# Altium project carrier.PrjPcb (part 1 of 2)
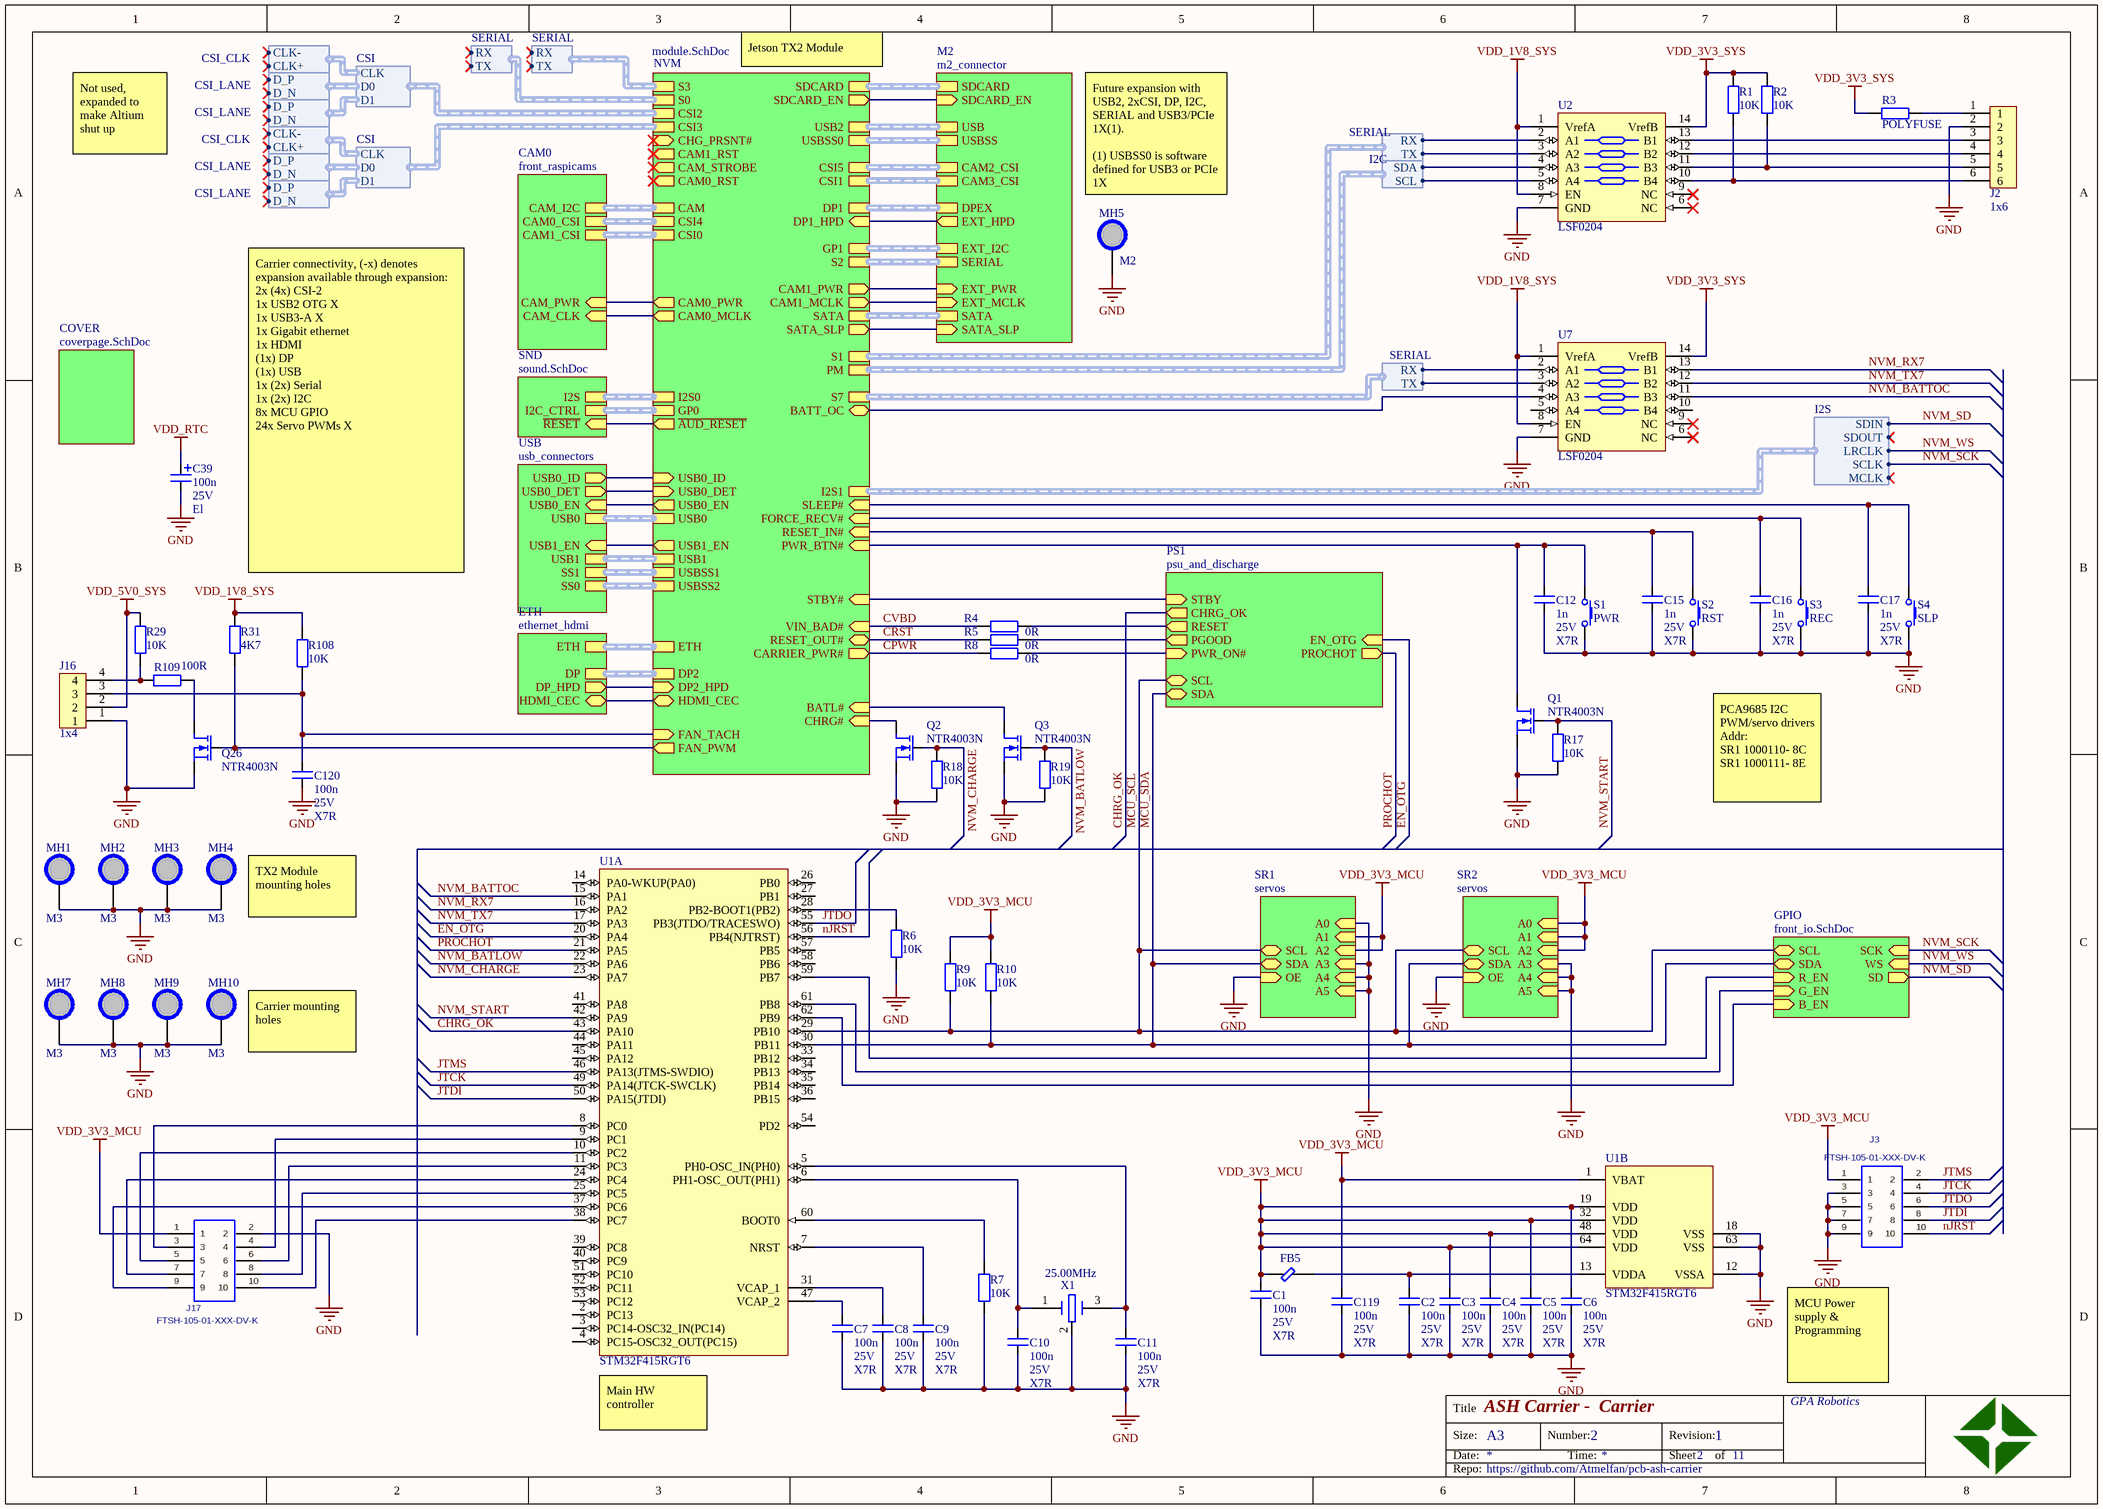
[diagram p0: carrier.SchDoc]
project_url: https://github.com/Atmelfan/pcb-ash-carrier; project_revision: 1; project_repo: https://github.com/Atmelfan/pcb-ash-carrier; project_name: ASH Carrier; project_author: Gustav Palmqvist
11 sheets, 384 parts. Net scope: hierarchical (ports join the sheet entries above them; power ports are global).
Board file: carrier.PcbDoc
Sheets:
  carrier.SchDoc
    NVM = module.SchDoc
    SR1 = servos.SchDoc
    SR2 = servos.SchDoc
    CAM0 = front_raspicams.SchDoc
    PS1 = psu_and_discharge.SchDoc
    USB = usb_connectors.SchDoc
    ETH = ethernet_hdmi.SchDoc
    M2 = m2_connector.SchDoc
    SND = sound.SchDoc
    GPIO = front_io.SchDoc
    COVER = coverpage.SchDoc

## Sheet carrier.SchDoc: Carrier
size A3; Organization: GPA Robotics; DocumentNumber: 2; Revision: REV 0; SheetNumber: 2; SheetTotal: 11

### Parts
C1  value 100n  Voltage: 25V  Type: X7R  [C1005[0402]]  (hidden comment: cap)
C2  value 100n  Voltage: 25V  Type: X7R  [C1005[0402]]  (hidden comment: cap)
C3  value 100n  Voltage: 25V  Type: X7R  [C1005[0402]]  (hidden comment: cap)
C4  value 100n  Voltage: 25V  Type: X7R  [C1005[0402]]  (hidden comment: cap)
C5  value 100n  Voltage: 25V  Type: X7R  [C1005[0402]]  (hidden comment: cap)
C6  value 100n  Voltage: 25V  Type: X7R  [C1005[0402]]  (hidden comment: cap)
C7  value 100n  Voltage: 25V  Type: X7R  [C1005[0402]]  (hidden comment: cap)
C8  value 100n  Voltage: 25V  Type: X7R  [C1005[0402]]  (hidden comment: cap)
C9  value 100n  Voltage: 25V  Type: X7R  [C1005[0402]]  (hidden comment: cap)
C10  value 100n  Voltage: 25V  Type: X7R  [C1005[0402]]  (hidden comment: cap)
C11  value 100n  Voltage: 25V  Type: X7R  [C1005[0402]]  (hidden comment: cap)
C12  value 1n  Voltage: 25V  Type: X7R  [C1005[0402]]  (hidden comment: cap)
C15  value 1n  Voltage: 25V  Type: X7R  [C1005[0402]]  (hidden comment: cap)
C16  value 1n  Voltage: 25V  Type: X7R  [C1005[0402]]  (hidden comment: cap)
C17  value 1n  Voltage: 25V  Type: X7R  [C1005[0402]]  (hidden comment: cap)
C39  value 100n  Voltage: 25V  Type: El  [SC_DSK-3R3H224U-HL]  (hidden comment: pcap)
C119  value 100n  Voltage: 25V  Type: X7R  [C1005[0402]]  (hidden comment: cap)
C120  value 100n  Voltage: 25V  Type: X7R  [C1005[0402]]  (hidden comment: cap)
FB5  2506036007Y3  [FBC1608X07N]  (value not drawn)
J2  1x6  [hdr_100mil_1x6]
J3  FTSH-105-01-XXX-DV-K  [FTSH-105-01-XXX-DV-K]
J16  1x4  [molex_picoblade_1x4]
J17  FTSH-105-01-XXX-DV-K  [FTSH-105-01-XXX-DV-K]
MH1  M3  [m3_pan_tight_round]
MH2  M3  [m3_pan_tight_round]
MH3  M3  [m3_pan_tight_round]
MH4  M3  [m3_pan_tight_round]
MH5  M2  [m2_pan_tight_round]
MH7  M3  [m3_pan_tight_round]
MH8  M3  [m3_pan_tight_round]
MH9  M3  [m3_pan_tight_round]
MH10  M3  [m3_pan_tight_round]
Q1  NTR4003N  [NCH_SOT95P237X110-3N]
Q2  NTR4003N  [NCH_SOT95P237X110-3N]
Q3  NTR4003N  [NCH_SOT95P237X110-3N]
Q26  NTR4003N  [NCH_SOT95P237X110-3N]
R1  value 10K  [R1005[0402]]  (hidden comment: res)
R2  value 10K  [R1005[0402]]  (hidden comment: res)
R3  value POLYFUSE  [R1005[0402]]  (hidden comment: res)
R4  value 0R  [R1005[0402]]  (hidden comment: res)
R5  value 0R  [R1005[0402]]  (hidden comment: res)
R6  value 10K  [R1005[0402]]  (hidden comment: res)
R7  value 10K  [R1005[0402]]  (hidden comment: res)
R8  value 0R  [R1005[0402]]  (hidden comment: res)
R9  value 10K  [R1005[0402]]  (hidden comment: res)
R10  value 10K  [R1005[0402]]  (hidden comment: res)
R17  value 10K  [R1005[0402]]  (hidden comment: res)
R18  value 10K  [R1005[0402]]  (hidden comment: res)
R19  value 10K  [R1005[0402]]  (hidden comment: res)
R29  value 10K  [R1005[0402]]  (hidden comment: res)
R31  value 4K7  [R1005[0402]]  (hidden comment: res)
R108  value 10K  [R1005[0402]]  (hidden comment: res)
R109  value 100R  [R1005[0402]]  (hidden comment: res)
S1  PWR  [SW_6MM_TACT]
S2  RST  [SW_6MM_TACT]
S3  REC  [SW_6MM_TACT]
S4  SLP  [SW_6MM_TACT]
U1  STM32F415RGT6  [STM-LQFP64_N]  (parts A,B of 2)
U2  LSF0204  [TI_TSOP65P640X120-14N]
U7  LSF0204  [TI_TSOP65P640X120-14N]
X1  value 25.00MHz  [FA-238]  (hidden comment: crystal_shielded)

### Sub-sheets
CAM0 = front_raspicams: CAM0_CSI (harness CSI), CAM_I2C (harness I2C), CAM_CLK (in), CAM_PWR (in), CAM1_CSI (harness CSI)
COVER = coverpage.SchDoc: no entries
ETH = ethernet_hdmi: ETH (harness GBE), DP (harness DP), DP_HPD (out), HDMI_CEC (bidir)
GPIO = front_io.SchDoc: SCL (bidir), SDA (bidir), WS (in), SCK (in), R_EN (in), G_EN (in), SD (out), B_EN (in)
M2 = m2_connector: SDCARD_EN (in), SDCARD (harness SDCARD), USB (harness USB2), USBSS (harness USB3), CAM2_CSI (harness CSI), CAM3_CSI (harness CSI), DPEX (harness DP), EXT_HPD (out), EXT_I2C (harness I2C), SERIAL (harness SERIAL), EXT_PWR (in), EXT_MCLK (in), SATA_SLP (in), SATA (harness SATA)
NVM = module.SchDoc: CHRG# (in), CSI5 (harness CSI), CSI0 (harness CSI), CSI4 (harness CSI), USB0 (harness USB2), CAM (harness I2C), USB0_ID (in), CSI3 (harness CSI), BATL# (in), PM (harness I2C), CSI2 (harness CSI), STBY# (in), CSI1 (harness CSI), GP1 (harness I2C), CAM_STROBE (out), SDCARD (harness SDCARD), CAM1_MCLK (out), CAM0_MCLK (out), S7 (harness SERIAL), CAM0_PWR (out), GP0 (harness I2C), SDCARD_EN (out), USB0_EN (out), PWR_BTN# (in), S3 (harness SERIAL), S2 (harness SERIAL), S1 (harness SERIAL), SLEEP# (in), CAM0_RST (out), CAM1_PWR (out), S0 (harness SERIAL), FORCE_RECV# (in), CAM1_RST (out), USB1_EN (out), USB0_DET (in), USBSS0 (harness USB3), CHG_PRSNT# (in), CARRIER_PWR# (out), RESET_IN# (in), USBSS2 (harness USB3), USBSS1 (harness USB3), VIN_BAD# (in), USB1 (harness USB2), RESET_OUT# (bidir), ETH (harness GBE), USB2 (harness USB2), DP1 (harness DP), DP1_HPD (in), DP2 (harness DP), DP2_HPD (in), I2S0 (harness I2S), BATT_OC (bidir), ~{AUD_RESET} (out), SATA (harness SATA), SATA_SLP (out), I2S1 (harness I2S), FAN_PWM (out), FAN_TACH (in), HDMI_CEC (bidir)
PS1 = psu_and_discharge: SCL (bidir), PWR_ON# (in), PGOOD (out), SDA (bidir), RESET (out), EN_OTG (in), PROCHOT (out), CHRG_OK (out), STBY (in)
SND = sound.SchDoc: ~{RESET} (in), I2S (harness I2S), I2C_CTRL (harness I2C)
SR1 = servos: SDA (bidir), SCL (bidir), OE (in), A1 (in), A2 (in), A3 (in), A0 (in), A4 (in), A5 (in)
SR2 = servos: SDA (bidir), SCL (bidir), OE (in), A1 (in), A2 (in), A3 (in), A0 (in), A4 (in), A5 (in)
USB = usb_connectors: USB0 (harness USB2), USB1 (harness USB2), SS1 (harness USB3), USB0_DET (out), USB0_EN (in), USB0_ID (out), USB1_EN (in), SS0 (harness USB3)

### Harnesses
SERIAL: RX, TX
I2C: SDA, SCL
I2S: SDIN, SDOUT, LRCLK, SCLK, MCLK
CSI: CLK, D0, D1
CSI_CLK: CLK-, CLK+
CSI_LANE: D_P, D_N

### Nets
GND: C1.2 C2.2 C3.2 C4.2 C5.2 C6.2 C7.2 C8.2 C9.2 C10.2 C11.2 C12.1 C15.1 C16.1 C17.1 C39.2 C119.2 C120.1 J2.2 J3.3 J3.5 J3.7 J3.9 J16.1 J17.2 MH1.1 MH2.1 MH3.1 MH4.1 MH5.1 MH7.1 MH8.1 MH9.1 MH10.1 Q1.S Q2.S Q3.S Q26.S R6.1 R7.1 R17.1 R18.1 R19.1 S1.2 S2.2 S3.2 S4.2 U1.12(VSSA) U1.18(VSS) U1.63(VSS) U2.7(GND) U7.7(GND) X1.2 ; sheet SR1/OE, sheet SR1/A3, sheet SR1/A0, sheet SR1/A4, sheet SR1/A5, sheet SR2/OE, sheet SR2/A3, sheet SR2/A4, sheet SR2/A5
VDD_1V8_SYS: R31.2 R108.2 U2.1(VrefA) U2.8(EN) U7.1(VrefA) U7.8(EN)
VDD_3V3_MCU: C1.1 C3.1 C4.1 C5.1 C6.1 C119.1 FB5.1 J3.1 J17.1 R9.2 R10.2 U1.1(VBAT) U1.19(VDD) U1.32(VDD) U1.48(VDD) U1.64(VDD) ; sheet SR1/A1, sheet SR1/A2, sheet SR2/A1, sheet SR2/A2, sheet SR2/A0
VDD_3V3_SYS: R1.2 R2.2 R3.2 U2.14(VrefB) U7.14(VrefB)
VDD_5V0_SYS: J16.2 R29.1
VDD_RTC: C39.1
CHRG_OK: U1.43(PA10) ; sheet PS1/CHRG_OK
CPWR: R8.1 ; sheet NVM/CARRIER_PWR#
CRST: R5.1 ; sheet NVM/RESET_OUT#
CVBD: R4.1 ; sheet NVM/VIN_BAD#
EN_OTG: U1.20(PA4) ; sheet PS1/EN_OTG
JTCK: J3.4 U1.49(PA14(JTCK-SWCLK))
JTDI: J3.8 U1.50(PA15(JTDI))
JTDO: J3.6 U1.55(PB3(JTDO/TRACESWO))
JTMS: J3.2 U1.46(PA13(JTMS-SWDIO))
MCU_SCL: R9.1 U1.29(PB10) ; sheet SR1/SCL, sheet SR2/SCL, sheet PS1/SCL, sheet GPIO/SCL
MCU_SDA: R10.1 U1.30(PB11) ; sheet SR1/SDA, sheet SR2/SDA, sheet PS1/SDA, sheet GPIO/SDA
nJRST: J3.10 U1.56(PB4(NJTRST))
NVM_BATLOW: Q3.G R19.2 U1.22(PA6)
NVM_BATTOC: U1.15(PA1) U7.11(B3)
NVM_CHARGE: Q2.G R18.2 U1.23(PA7)
NVM_RX7: U1.16(PA2) U7.13(B1)
NVM_SCK: sheet GPIO/SCK, sheet NVM/I2S1.SCLK
NVM_SD: sheet GPIO/SD, sheet NVM/I2S1.SDIN
NVM_START: Q1.G R17.2 U1.42(PA9)
NVM_TX7: U1.17(PA3) U7.12(B2)
NVM_WS: sheet GPIO/WS, sheet NVM/I2S1.LRCLK
PROCHOT: U1.21(PA5) ; sheet PS1/PROCHOT
NetC2_1: C2.1 FB5.2 U1.13(VDDA)
NetC7_1: C7.1 U1.47(VCAP_2)
NetC8_1: C8.1 U1.31(VCAP_1)
NetC9_1: C9.1 U1.7(NRST)
NetC10_1: C10.1 U1.6(PH1-OSC_OUT(PH1)) X1.1
NetC11_1: C11.1 U1.5(PH0-OSC_IN(PH0)) X1.3
NetC12_2: C12.2 Q1.D S1.1 ; sheet NVM/PWR_BTN#
NetC15_2: C15.2 S2.1 ; sheet NVM/RESET_IN#
NetC16_2: C16.2 S3.1 ; sheet NVM/FORCE_RECV#
NetC17_2: C17.2 S4.1 ; sheet NVM/SLEEP#
NetC94_2: sheet NVM/USB0_DET, sheet USB/USB0_DET
NetC120_2: C120.2 J16.3 R108.1 ; sheet NVM/FAN_TACH
NetD13_5: sheet NVM/USB0_ID, sheet USB/USB0_ID
NetJ1_A6: U2.5(A4) ; sheet NVM/PM.SCL
NetJ1_A7: Q2.D ; sheet NVM/CHRG#
NetJ1_A17: sheet NVM/USB0_EN, sheet USB/USB0_EN
NetJ1_A18: sheet NVM/USB1_EN, sheet USB/USB1_EN
NetJ1_A33: sheet NVM/DP1_HPD, sheet M2/EXT_HPD
NetJ1_B6: U2.4(A3) ; sheet NVM/PM.SDA
NetJ1_B7: sheet NVM/STBY#, sheet PS1/STBY
NetJ1_B33: sheet NVM/HDMI_CEC, sheet ETH/HDMI_CEC
NetJ1_B36: sheet NVM/DP2_HPD, sheet ETH/DP_HPD
NetJ1_C7: Q3.D ; sheet NVM/BATL#
NetJ1_C8: U7.4(A3) ; sheet NVM/BATT_OC
NetJ1_C16: Q26.G R31.1 ; sheet NVM/FAN_PWM
NetJ1_D5: U7.2(A1) ; sheet NVM/S7.RX
NetJ1_D8: U7.3(A2) ; sheet NVM/S7.TX
NetJ1_D9: U2.3(A2) ; sheet NVM/S1.TX
NetJ1_D10: U2.2(A1) ; sheet NVM/S1.RX
NetJ1_D47: sheet NVM/SATA_SLP, sheet M2/SATA_SLP
NetJ1_F2: sheet NVM/~{AUD_RESET}, sheet SND/~{RESET}
NetJ1_F7: sheet NVM/CAM1_PWR, sheet M2/EXT_PWR
NetJ1_F8: sheet NVM/CAM1_MCLK, sheet M2/EXT_MCLK
NetJ1_F9: sheet NVM/CAM0_MCLK, sheet CAM0/CAM_CLK
NetJ1_G8: sheet NVM/CAM0_PWR, sheet CAM0/CAM_PWR
NetJ1_H16: sheet NVM/SDCARD_EN, sheet M2/SDCARD_EN
NetJ2_1: J2.1 R3.1
NetJ2_3: J2.3 U2.13(B1)
NetJ2_4: J2.4 U2.12(B2)
NetJ2_5: J2.5 R2.1 U2.11(B3)
NetJ2_6: J2.6 R1.1 U2.10(B4)
NetJ16_4: J16.4 R29.2 R109.1
NetJ17_3: J17.3 U1.8(PC0)
NetJ17_4: J17.4 U1.9(PC1)
NetJ17_5: J17.5 U1.10(PC2)
NetJ17_6: J17.6 U1.11(PC3)
NetJ17_7: J17.7 U1.24(PC4)
NetJ17_8: J17.8 U1.25(PC5)
NetJ17_9: J17.9 U1.37(PC6)
NetJ17_10: J17.10 U1.38(PC7)
NetQ9_G: R4.2 ; sheet PS1/RESET
NetQ10_D: R5.2 ; sheet PS1/PGOOD
NetQ13_G: R8.2 ; sheet PS1/PWR_ON#
NetQ26_D: Q26.D R109.2
NetR6_2: R6.2 U1.28(PB2-BOOT1(PB2))
NetR7_2: R7.2 U1.60(BOOT0)
NetU1_59: U1.59(PB7) ; sheet GPIO/R_EN
NetU1_61: U1.61(PB8) ; sheet GPIO/G_EN
NetU1_62: U1.62(PB9) ; sheet GPIO/B_EN

Not connected (* = marked no-connect by the designer): U1 2(PC13) 3(PC14-OSC32_IN(PC14)) 4(PC15-OSC32_OUT(PC15)) 14(PA0-WKUP(PA0)) 26(PB0) 27(PB1) 33(PB12) 34(PB13) 35(PB14) 36(PB15) 39(PC8) 40(PC9) 41(PA8) 44(PA11) 45(PA12) 51(PC10) 52(PC11) 53(PC12) 54(PD2) 57(PB5) 58(PB6); U2 6(NC)* 9(NC)*; U7 5(A4) 6(NC)* 9(NC)* 10(B4)

### Buses and harness runs
harness sheet CAM0/CAM0_CSI = sheet NVM/CSI4
harness sheet CAM0/CAM1_CSI = sheet NVM/CSI0
harness sheet CAM0/CAM_I2C = sheet NVM/CAM
harness sheet ETH/DP = sheet NVM/DP2
harness sheet ETH/ETH = sheet NVM/ETH
harness sheet M2/CAM2_CSI = sheet NVM/CSI5
harness sheet M2/CAM3_CSI = sheet NVM/CSI1
harness sheet M2/DPEX = sheet NVM/DP1
harness sheet M2/EXT_I2C = sheet NVM/GP1
harness sheet M2/SATA = sheet NVM/SATA
harness sheet M2/SDCARD = sheet NVM/SDCARD
harness sheet M2/SERIAL = sheet NVM/S2
harness sheet M2/USB = sheet NVM/USB2
harness sheet M2/USBSS = sheet NVM/USBSS0
harness sheet NVM/GP0 = sheet SND/I2C_CTRL
harness sheet NVM/I2S0 = sheet SND/I2S
harness sheet NVM/USB0 = sheet USB/USB0
harness sheet NVM/USB1 = sheet USB/USB1
harness sheet NVM/USBSS1 = sheet USB/SS1
harness sheet NVM/USBSS2 = sheet USB/SS0

### Notes on the sheet
- Jetson TX2 Module
- Not used, expanded to make Altium shut up
- Future expansion with USB2, 2xCSI, DP, I2C, SERIAL and USB3/PCIe 1X(1).
  (1) USBSS0 is software defined for USB3 or PCIe 1X
- Carrier connectivity, (-x) denotes expansion available through expansion:
  2x (4x) CSI-2
  1x USB2 OTG X
  1x USB3-A X
  1x Gigabit ethernet
  1x HDMI
  (1x) DP
  (1x) USB
  1x (2x) Serial
  1x (2x) I2C
  8x MCU GPIO
  24x Servo PWMs X
- PCA9685 I2C PWM/servo drivers
  Addr:
  SR1 1000110- 8C
  SR1 1000111- 8E
- (near MH4) TX2 Module mounting holes
- (near MH10) Carrier mounting holes
- MCU Power supply & Programming
- (near U1) Main HW controller
- Title
- Size:
- Date:
- A3
- Number:
- Time:
- Revision:
- Sheet
- of
- Repo:

### Library data of the parts
C1-C12 C15-C17 C119 C120 = cap: Capacitor; Manufacturer: *; Series: *
C39 = pcap: Polarized capacitor; Manufacturer: *; Series: *
FB5 = ferrite_bead: Ferrite bead
J2 = header_1x6
J3 J17 = FTSH-105-01-XXX-DV-K: TERMINAL STRIP, .050"(1.27mm) PITCH, 10 PINS, KEYED; MANUFACTURER: SAMTEC; CREATED: November 30, 2016 - Wendy Xin; PCB DECAL: FTSH-105-01-XXX-DV-K
J16 = header_1x4
MH1-MH5 MH7-MH10 = mounting_hole
Q1-Q3 Q26 = nch_mosfet
R1-R10 R17-R19 = res: Resistor
R29 R31 R108 R109 = res: Resistor; Tolerance: 5%
S1-S4 = btn
  S1: Text: PWR
  S2: Text: RST
  S3: Text: REC
  S4: Text: SLP
U1 = STM32F415RGT6: ARM Cortex-M4 32-bit MCU+FPU, 210 DMIPS, 1024 kB Flash, 192 kB Internal RAM, 51 I/Os, 64-pin LQFP, -40 to 85 degC, Tray; Manufacturer: STMicroelectronics; D/A Converter: 2x12-bit; FLASH Size (Prog) (kB): 1024; I/Os (High Current): 51; Internal RAM Size (kB): 192; Operating Frequency(F) (Processor speed) (MHz): 168; Supply Voltage(Vcc) max (V): 3.6; Supply Voltage(Vcc) min (V): 1.8; DatasheetVersion: Rev. 4; PackageVersion: Rev. 4, 06/2013; PackageReference: LQFP64; PackageDescription: 64-Pin Low Profile Quad Flat Package, 10 x 10 mm Body, 0.5 mm Pitch; Supplier 1: Digi-Key; Supplier Part Number 1: 497-11907-ND; Supplier 2: Farnell; Supplier Part Number 2: 2064370; Supplier 3: Newark; Supplier Part Number 3: 73T2335; Supplier 4: Mouser; Supplier Part Number 4: 511-STM32F415RGT6; Core: ARM Cortex-M4; Packing: Tray; Mounting Technology: Surface Mount; PartNumber: STM32F415RGT6; ComponentLink1Description: Manufacturer URL; ComponentLink1URL: http://www.st.com/web/en/home.html; ComponentLink2Description: Datasheet; ComponentLink2URL: http://www.st.com/st-web-ui/static/active/en/resource/technical/document/datasheet/DM00035129.pdf; ComponentLink3Description: Package Specification; ComponentLink3URL: http://www.st.com/st-web-ui/static/active/en/resource/technical/document/datasheet/DM00037051.pdf
X1 = crystal_shielded: Crystal with shield

## Sheet module.SchDoc: NVM connections
size A3; Organization: GPA Robotics; DocumentNumber: 3; Revision: REV 0; SheetNumber: 3; SheetTotal: 11
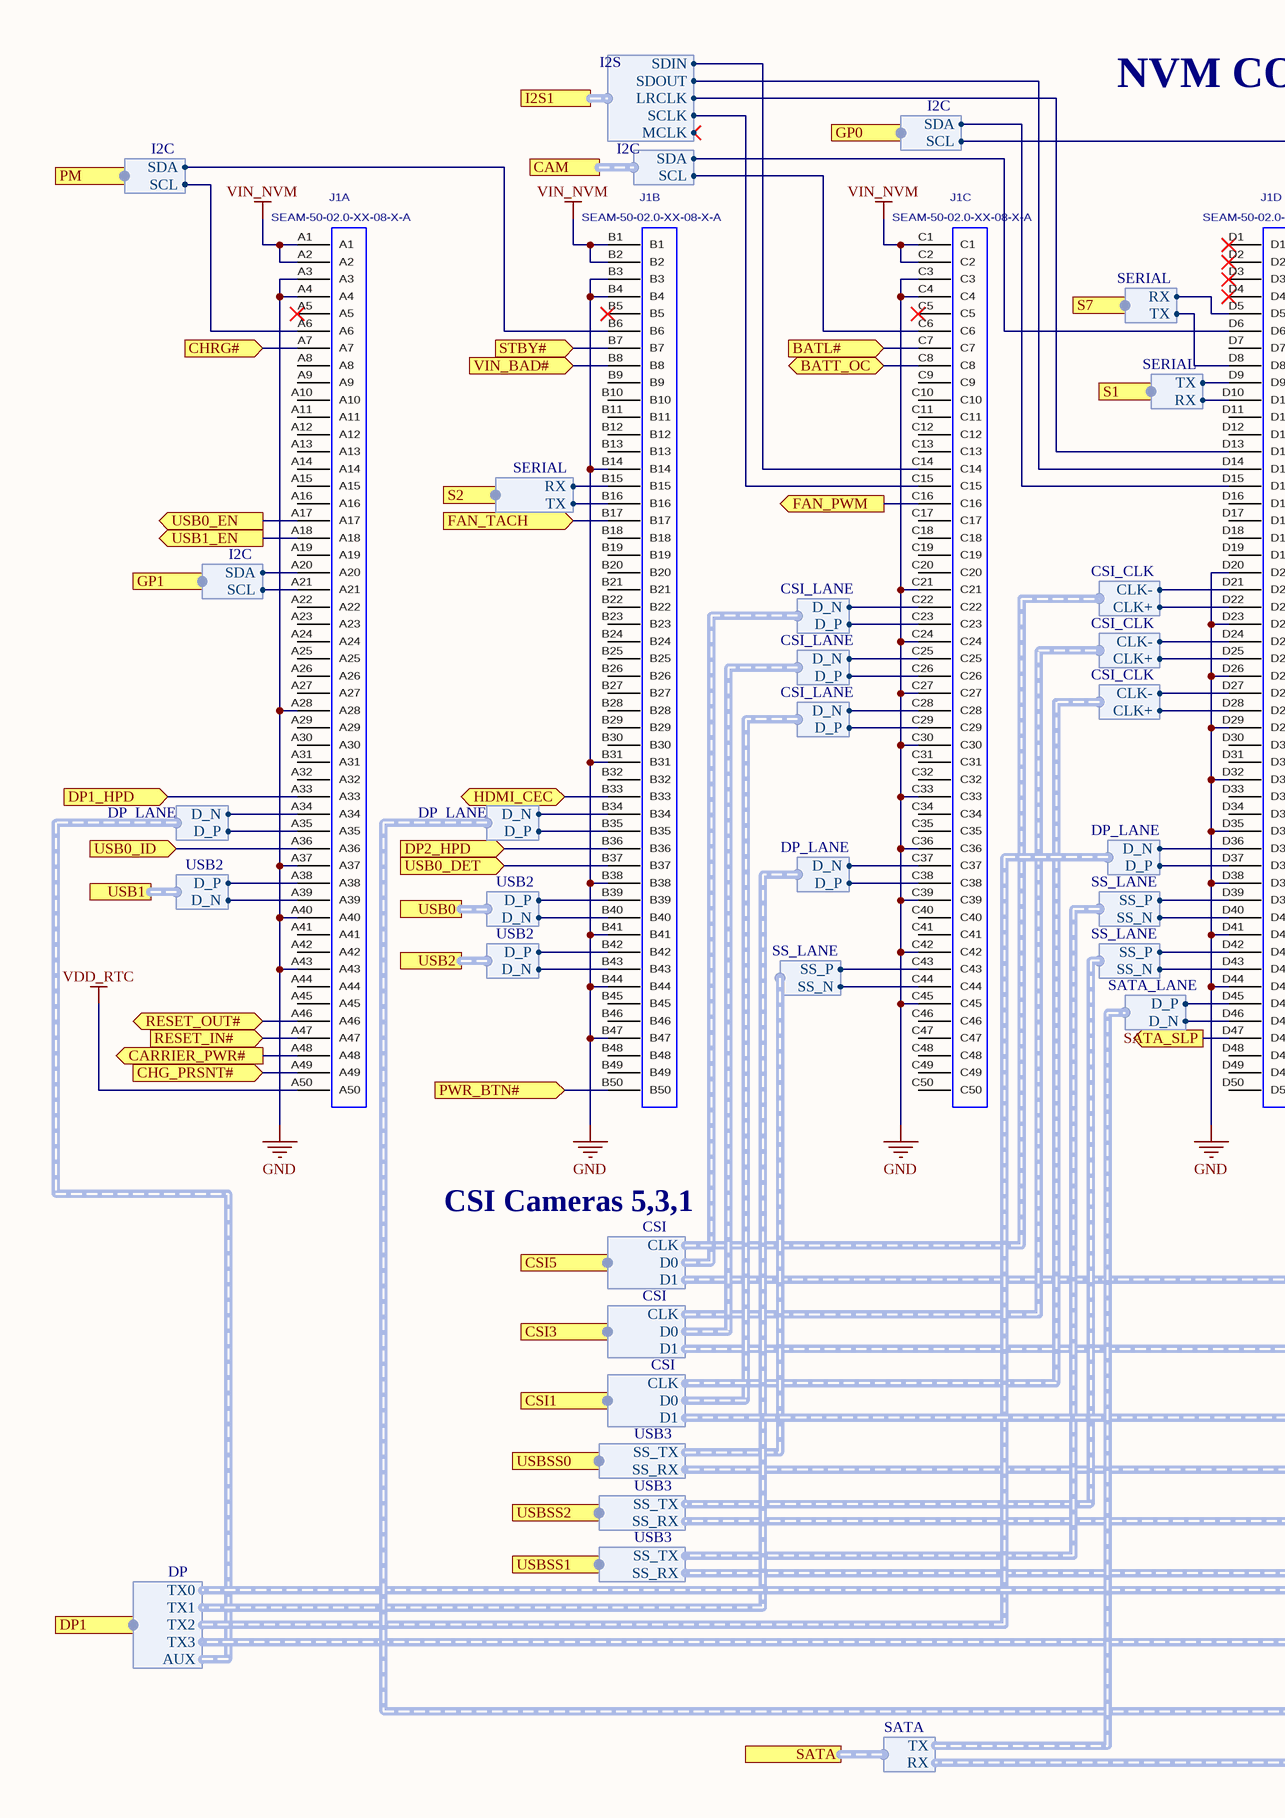
[diagram p1: module.SchDoc, left]
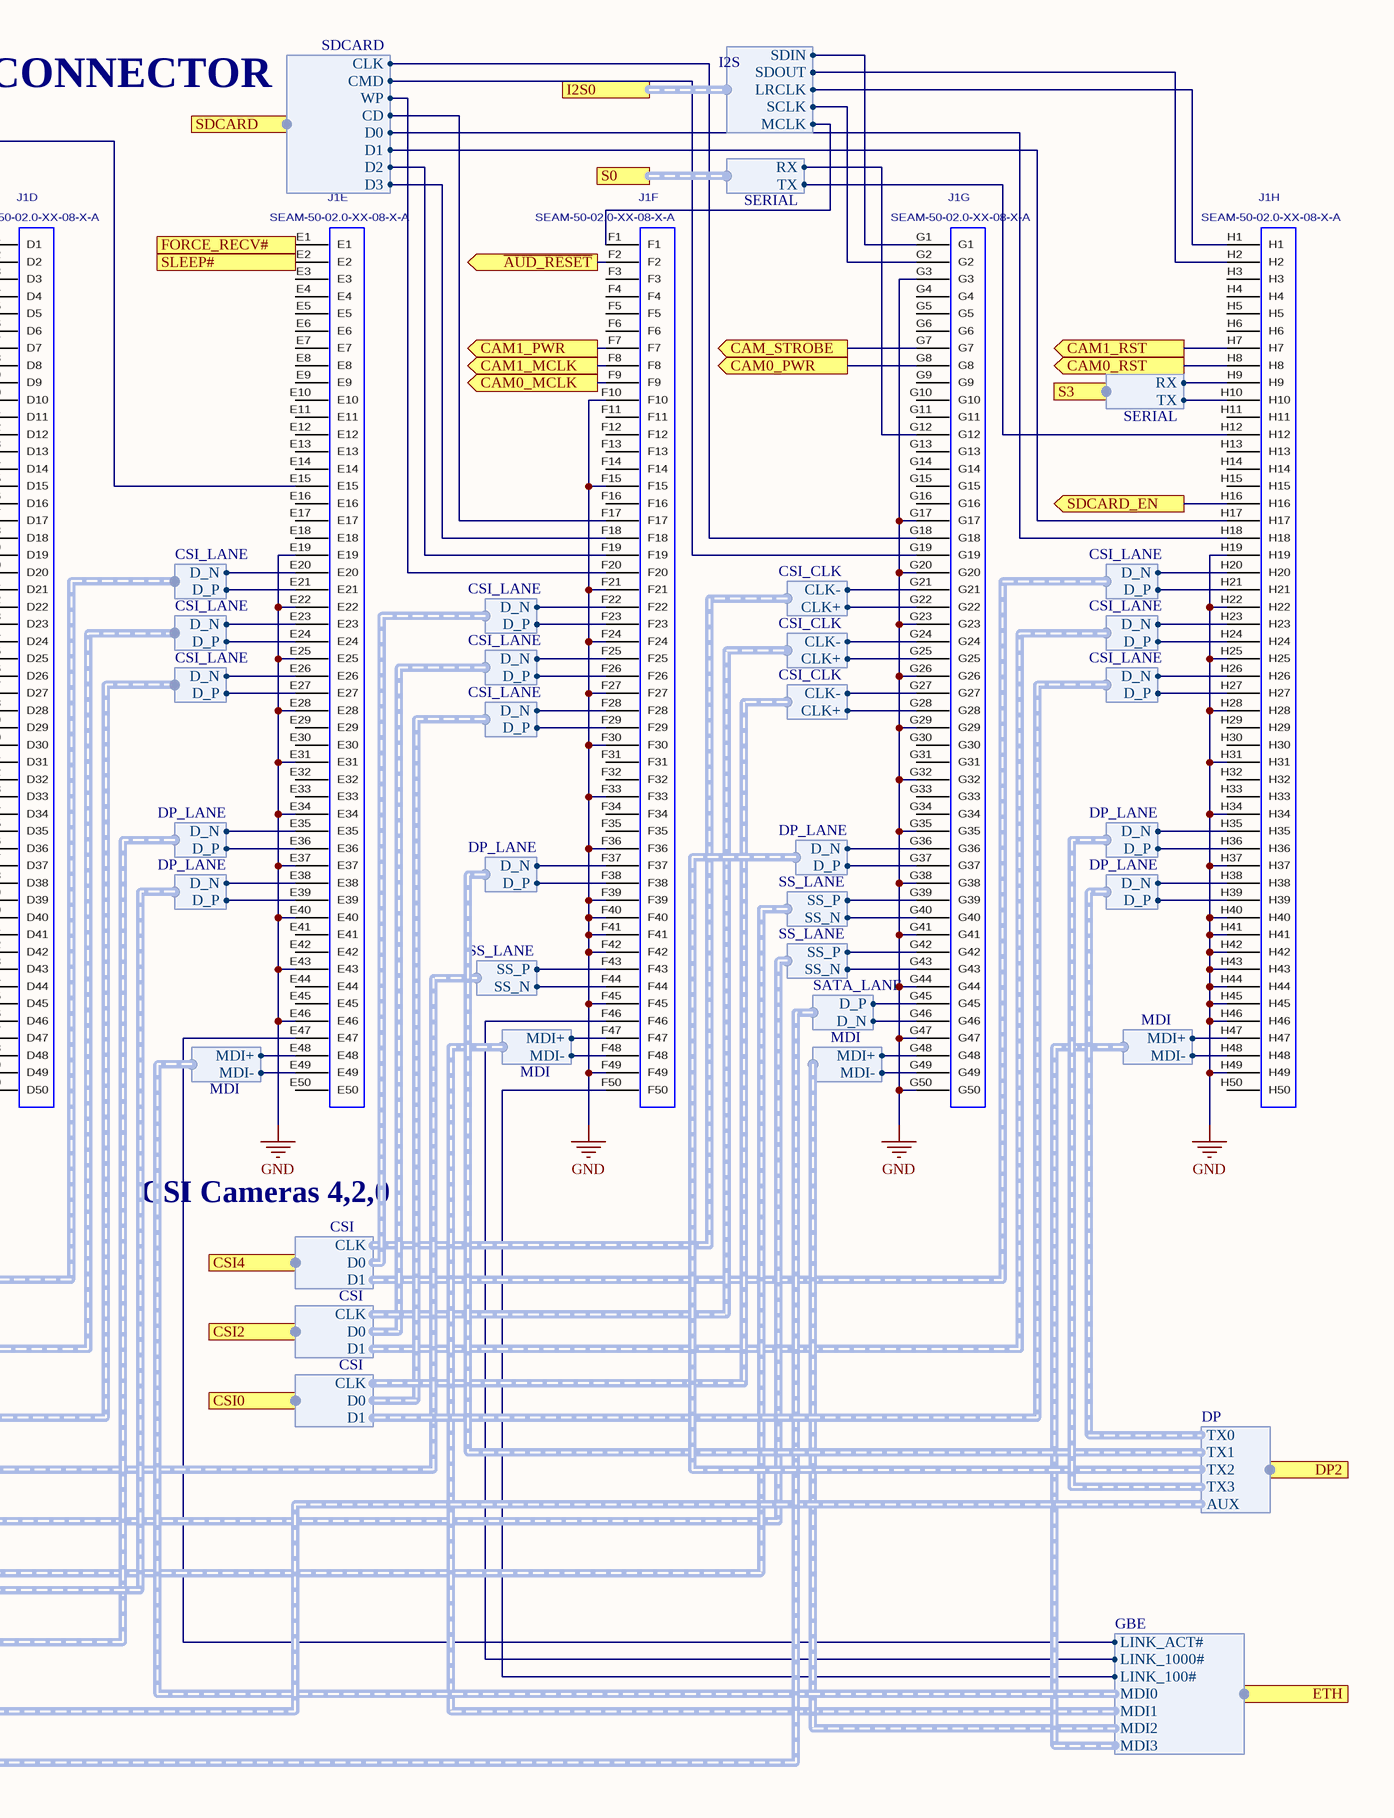
[diagram p2: module.SchDoc, right]

### Parts
J1  SEAM-50-02.0-XX-08-X-A  [SEAM-50-02.0-XX-08-X-A]  (parts A,B,C,D,E,F,G,H of 8)

### Ports
BATL# (in), BATT_OC (bidir), CAM0_MCLK (out), CAM0_PWR (out), CAM0_RST (out), CAM1_MCLK (out), CAM1_PWR (out), CAM1_RST (out), CAM (harness I2C), CAM_STROBE (out), CARRIER_PWR# (out), CHG_PRSNT# (in), CHRG# (in), CSI0 (harness CSI), CSI1 (harness CSI), CSI2 (harness CSI), CSI3 (harness CSI), CSI4 (harness CSI), CSI5 (harness CSI), DP1 (harness DP), DP1_HPD (in), DP2 (harness DP), DP2_HPD (in), ETH (harness GBE), FAN_PWM (out), FAN_TACH (in), FORCE_RECV# (in), GP0 (harness I2C), GP1 (harness I2C), HDMI_CEC (bidir), I2S0 (harness I2S), I2S1 (harness I2S), PM (harness I2C), PWR_BTN# (in), RESET_IN# (in), RESET_OUT# (bidir), S0 (harness SERIAL), S1 (harness SERIAL), S2 (harness SERIAL), S3 (harness SERIAL), S7 (harness SERIAL), SATA (harness SATA), SATA_SLP (out), SDCARD (harness SDCARD), SDCARD_EN (out), SLEEP# (in), STBY# (in), USB0 (harness USB2), USB0_DET (in), USB0_EN (out), USB0_ID (in), USB1 (harness USB2), USB1_EN (out), USB2 (harness USB2), USBSS0 (harness USB3), USBSS1 (harness USB3), USBSS2 (harness USB3), VIN_BAD# (in), ~{AUD_RESET} (out)

### Harnesses
CSI_CLK: CLK+, CLK-
CSI_LANE: D_P, D_N
CSI: D0, CLK, D1
USB3: SS_RX, SS_TX
USB2: D_P, D_N
I2C: SDA, SCL
SS_LANE: SS_P, SS_N
GBE: LINK_ACT#, LINK_1000#, LINK_100#, MDI0, MDI1, MDI2, MDI3
MDI: MDI+, MDI-
SDCARD: CLK, CMD, WP, CD, D0, D1, D2, D3
SERIAL: RX, TX
DP: TX1, TX0, TX2, TX3, AUX
DP_LANE: D_P, D_N
SATA: TX, RX
SATA_LANE: D_P, D_N
I2S: SDIN, SDOUT, LRCLK, SCLK, MCLK

### Nets
GND: J1.A3 J1.A4 J1.A28 J1.A37 J1.A40 J1.A43 J1.B3 J1.B4 J1.B14 J1.B31 J1.B38 J1.B41 J1.B44 J1.B47 J1.C3 J1.C4 J1.C21 J1.C24 J1.C27 J1.C30 J1.C33 J1.C36 J1.C39 J1.C42 J1.C45 J1.D20 J1.D23 J1.D26 J1.D29 J1.D32 J1.D35 J1.D38 J1.D41 J1.D44 J1.E19 J1.E22 J1.E25 J1.E28 J1.E31 J1.E34 J1.E37 J1.E40 J1.E43 J1.E46 J1.F10 J1.F15 J1.F21 J1.F24 J1.F27 J1.F30 J1.F33 J1.F36 J1.F39 J1.F40 J1.F41 J1.F42 J1.F45 J1.F49 J1.G3 J1.G17 J1.G20 J1.G23 J1.G26 J1.G29 J1.G32 J1.G35 J1.G38 J1.G41 J1.G44 J1.G47 J1.G50 J1.H19 J1.H22 J1.H25 J1.H28 J1.H31 J1.H34 J1.H37 J1.H40 J1.H41 J1.H42 J1.H43 J1.H44 J1.H45 J1.H46 J1.H49
VDD_RTC: J1.A50
VIN_NVM: J1.A1 J1.A2 J1.B1 J1.B2 J1.C1 J1.C2
CPWR: J1.A48 ; port CARRIER_PWR#
CRST: J1.A46 ; port RESET_OUT#
CSI0_CLK_N: J1.G21 ; harness CSI_CLK.CLK-
CSI0_CLK_P: J1.G22 ; harness CSI_CLK.CLK+
CSI0_D0_N: J1.F22 ; harness CSI_LANE.D_N
CSI0_D0_P: J1.F23 ; harness CSI_LANE.D_P
CSI0_D1_N: J1.H20 ; harness CSI_LANE.D_N
CSI0_D1_P: J1.H21 ; harness CSI_LANE.D_P
CSI1_CLK_N: J1.G27 ; harness CSI_CLK.CLK-
CSI1_CLK_P: J1.G28 ; harness CSI_CLK.CLK+
CSI1_D0_N: J1.F28 ; harness CSI_LANE.D_N
CSI1_D0_P: J1.F29 ; harness CSI_LANE.D_P
CSI1_D1_N: J1.H26 ; harness CSI_LANE.D_N
CSI1_D1_P: J1.H27 ; harness CSI_LANE.D_P
CSI2_CLK_N: J1.D21 ; harness CSI_CLK.CLK-
CSI2_CLK_P: J1.D22 ; harness CSI_CLK.CLK+
CSI2_D0_N: J1.C22 ; harness CSI_LANE.D_N
CSI2_D0_P: J1.C23 ; harness CSI_LANE.D_P
CSI2_D1_N: J1.E20 ; harness CSI_LANE.D_N
CSI2_D1_P: J1.E21 ; harness CSI_LANE.D_P
CSI3_CLK_N: J1.D27 ; harness CSI_CLK.CLK-
CSI3_CLK_P: J1.D28 ; harness CSI_CLK.CLK+
CSI3_D0_N: J1.C28 ; harness CSI_LANE.D_N
CSI3_D0_P: J1.C29 ; harness CSI_LANE.D_P
CSI3_D1_N: J1.E26 ; harness CSI_LANE.D_N
CSI3_D1_P: J1.E27 ; harness CSI_LANE.D_P
CVBD: J1.B8 ; port VIN_BAD#
DP0_D0_N: J1.H38 ; harness DP_LANE.D_N
DP0_D0_P: J1.H39 ; harness DP_LANE.D_P
DP0_D1_N: J1.F37 ; harness DP_LANE.D_N
DP0_D1_P: J1.F38 ; harness DP_LANE.D_P
DP0_D2_N: J1.G36 ; harness DP_LANE.D_N
DP0_D2_P: J1.G37 ; harness DP_LANE.D_P
DP0_D3_N: J1.H35 ; harness DP_LANE.D_N
DP0_D3_P: J1.H36 ; harness DP_LANE.D_P
DPM2_AUX_N: J1.A34 ; harness DP_LANE.D_N
DPM2_AUX_P: J1.A35 ; harness DP_LANE.D_P
DPM2_D0_N: J1.E35 ; harness DP_LANE.D_N
DPM2_D0_P: J1.E36 ; harness DP_LANE.D_P
DPM2_D1_N: J1.D36 ; harness DP_LANE.D_N
DPM2_D1_P: J1.D37 ; harness DP_LANE.D_P
DPM2_D2_N: J1.C37 ; harness DP_LANE.D_N
DPM2_D2_P: J1.C38 ; harness DP_LANE.D_P
DPM2_D3_N: J1.E38 ; harness DP_LANE.D_N
DPM2_D3_P: J1.E39 ; harness DP_LANE.D_P
MDI0_N: J1.E49 ; harness MDI.MDI-
MDI0_P: J1.E48 ; harness MDI.MDI+
MDI1_N: J1.F48 ; harness MDI.MDI-
MDI1_P: J1.F47 ; harness MDI.MDI+
MDI2_N: J1.G49 ; harness MDI.MDI-
MDI2_P: J1.G48 ; harness MDI.MDI+
MDI3_N: J1.H48 ; harness MDI.MDI-
MDI3_P: J1.H47 ; harness MDI.MDI+
NVM_SCK: J1.C15 ; port I2S1.SCLK
NVM_SD: J1.C14 ; port I2S1.SDIN
NVM_WS: J1.D13 ; port I2S1.LRCLK
SATA_RX_N: J1.G45 ; harness SATA_LANE.D_P
SATA_RX_P: J1.G46 ; harness SATA_LANE.D_N
SATA_TX_N: J1.D45 ; harness SATA_LANE.D_P
SATA_TX_P: J1.D46 ; harness SATA_LANE.D_N
SDC_CLK: J1.G18 ; port SDCARD.CLK
SDC_CMD: J1.G19 ; port SDCARD.CMD
SDC_D0: J1.H18 ; port SDCARD.D0
SDC_D1: J1.H17 ; port SDCARD.D1
SDC_D2: J1.F19 ; port SDCARD.D2
SDC_D3: J1.F18 ; port SDCARD.D3
USB0_D_N: J1.B40 ; port USB0.D_N
USB0_D_P: J1.B39 ; port USB0.D_P
USB0_RX_N: J1.G40 ; harness SS_LANE.SS_N
USB0_RX_P: J1.G39 ; harness SS_LANE.SS_P
USB0_TX_N: J1.D40 ; harness SS_LANE.SS_N
USB0_TX_P: J1.D39 ; harness SS_LANE.SS_P
USB1_D_N: J1.A39 ; port USB1.D_N
USB1_D_P: J1.A38 ; port USB1.D_P
USB1_RX_N: J1.G43 ; harness SS_LANE.SS_N
USB1_RX_P: J1.G42 ; harness SS_LANE.SS_P
USB1_TX_N: J1.D43 ; harness SS_LANE.SS_N
USB1_TX_P: J1.D42 ; harness SS_LANE.SS_P
USBM2_D_N: J1.B43 ; port USB2.D_N
USBM2_D_P: J1.B42 ; port USB2.D_P
USBM2_RX_N: J1.F44 ; harness SS_LANE.SS_N
USBM2_RX_P: J1.F43 ; harness SS_LANE.SS_P
USBM2_TX_N: J1.C44 ; harness SS_LANE.SS_N
USBM2_TX_P: J1.C43 ; harness SS_LANE.SS_P
NetC12_2: J1.B50 ; port PWR_BTN#
NetC15_2: J1.A47 ; port RESET_IN#
NetC16_2: J1.E1 ; port FORCE_RECV#
NetC17_2: J1.E2 ; port SLEEP#
NetC94_2: J1.B37 ; port USB0_DET
NetC120_2: J1.B17 ; port FAN_TACH
NetD13_5: J1.A36 ; port USB0_ID
NetD14_4: J1.F17 ; port SDCARD.CD
NetJ1_A6: J1.A6 ; port PM.SCL
NetJ1_A7: J1.A7 ; port CHRG#
NetJ1_A17: J1.A17 ; port USB0_EN
NetJ1_A18: J1.A18 ; port USB1_EN
NetJ1_A20: J1.A20 ; port GP1.SDA
NetJ1_A21: J1.A21 ; port GP1.SCL
NetJ1_A33: J1.A33 ; port DP1_HPD
NetJ1_A49: J1.A49 ; port CHG_PRSNT#
NetJ1_B6: J1.B6 ; port PM.SDA
NetJ1_B7: J1.B7 ; port STBY#
NetJ1_B15: J1.B15 ; port S2.RX
NetJ1_B16: J1.B16 ; port S2.TX
NetJ1_B33: J1.B33 ; port HDMI_CEC
NetJ1_B34: J1.B34 ; harness DP_LANE.D_N
NetJ1_B35: J1.B35 ; harness DP_LANE.D_P
NetJ1_B36: J1.B36 ; port DP2_HPD
NetJ1_C6: J1.C6 ; port CAM.SCL
NetJ1_C7: J1.C7 ; port BATL#
NetJ1_C8: J1.C8 ; port BATT_OC
NetJ1_C16: J1.C16 ; port FAN_PWM
NetJ1_C25: J1.C25 ; harness CSI_LANE.D_N
NetJ1_C26: J1.C26 ; harness CSI_LANE.D_P
NetJ1_D5: J1.D5 ; port S7.RX
NetJ1_D6: J1.D6 ; port CAM.SDA
NetJ1_D8: J1.D8 ; port S7.TX
NetJ1_D9: J1.D9 ; port S1.TX
NetJ1_D10: J1.D10 ; port S1.RX
NetJ1_D14: J1.D14 ; port I2S1.SDOUT
NetJ1_D15: J1.D15 ; port GP0.SDA
NetJ1_D24: J1.D24 ; harness CSI_CLK.CLK-
NetJ1_D25: J1.D25 ; harness CSI_CLK.CLK+
NetJ1_D47: J1.D47 ; port SATA_SLP
NetJ1_E15: J1.E15 ; port GP0.SCL
NetJ1_E23: J1.E23 ; harness CSI_LANE.D_N
NetJ1_E24: J1.E24 ; harness CSI_LANE.D_P
NetJ1_E47: J1.E47 ; port ETH.LINK_ACT#
NetJ1_F1: J1.F1 ; port I2S0.MCLK
NetJ1_F2: J1.F2 ; port ~{AUD_RESET}
NetJ1_F7: J1.F7 ; port CAM1_PWR
NetJ1_F8: J1.F8 ; port CAM1_MCLK
NetJ1_F9: J1.F9 ; port CAM0_MCLK
NetJ1_F20: J1.F20 ; port SDCARD.WP
NetJ1_F25: J1.F25 ; harness CSI_LANE.D_N
NetJ1_F26: J1.F26 ; harness CSI_LANE.D_P
NetJ1_F46: J1.F46 ; port ETH.LINK_1000#
NetJ1_F50: J1.F50 ; port ETH.LINK_100#
NetJ1_G1: J1.G1 ; port I2S0.SDIN
NetJ1_G2: J1.G2 ; port I2S0.SCLK
NetJ1_G7: J1.G7 ; port CAM_STROBE
NetJ1_G8: J1.G8 ; port CAM0_PWR
NetJ1_G12: J1.G12 ; port S0.RX
NetJ1_G24: J1.G24 ; harness CSI_CLK.CLK-
NetJ1_G25: J1.G25 ; harness CSI_CLK.CLK+
NetJ1_H1: J1.H1 ; port I2S0.LRCLK
NetJ1_H2: J1.H2 ; port I2S0.SDOUT
NetJ1_H7: J1.H7 ; port CAM1_RST
NetJ1_H8: J1.H8 ; port CAM0_RST
NetJ1_H9: J1.H9 ; port S3.RX
NetJ1_H10: J1.H10 ; port S3.TX
NetJ1_H12: J1.H12 ; port S0.TX
NetJ1_H16: J1.H16 ; port SDCARD_EN
NetJ1_H23: J1.H23 ; harness CSI_LANE.D_N
NetJ1_H24: J1.H24 ; harness CSI_LANE.D_P

Not connected (* = marked no-connect by the designer): J1 A5* A8 A9 A10 A11 A12 A13 A14 A15 A16 A19 A22 A23 A24 A25 A26 A27 A29 A30 A31 A32 A41 A42 A44 A45 B5* B9 B10 B11 B12 B13 B18 B19 B20 B21 B22 B23 B24 B25 B26 B27 B28 B29 B30 B32 B45 B46 B48 B49 C5* C9 C10 C11 C12 C13 C17 C18 C19 C20 C31 C32 C34 C35 C40 C41 C46 C47 C48 C49 C50 D1* D2* D3* D4* D7 D11 D12 D16 D17 D18 D19 D30 D31 D33 D34 D48 D49 D50 E3 E4 E5 E6 E7 E8 E9 E10 E11 E12 E13 E14 E16 E17 E18 E29 E30 E32 E33 E41 E42 E44 E45 E50 F3 F4 F5 F6 F11 F12 F13 F14 F16 F31 F32 F34 F35 G4 G5 G6 G9 G10 G11 G13 G14 G15 G16 G30 G31 G33 G34 H3 H4 H5 H6 H11 H13 H14 H15 H29 H30 H32 H33 H50

### Notes on the sheet
- NVM CONNECTOR
- CSI Cameras 5,3,1
- CSI Cameras 4,2,0
- Title
- Size:
- Date:
- A3
- Number:
- Time:
- Revision:
- Sheet
- of
- Repo:

### Library data of the parts
J1 = SEAM-50-02.0-XX-08-X-A: 0.050" TERMINAL ASSEMBLY.; MANUFACTURER: SAMTEC; CREATED: December 10, 2015 -Wendy Xin; PCB DECAL: SEAM-50-02.0-XX-08-X-A

## Sheet servos.SchDoc: Servo driver
size A4; Organization: GPA Robotics; DocumentNumber: 5; Revision: REV 0; SheetNumber: 5; SheetTotal: 11
Used 2 times, as channels SR1, SR2. Parts and nets are listed once, with the designators drawn on the sheet.
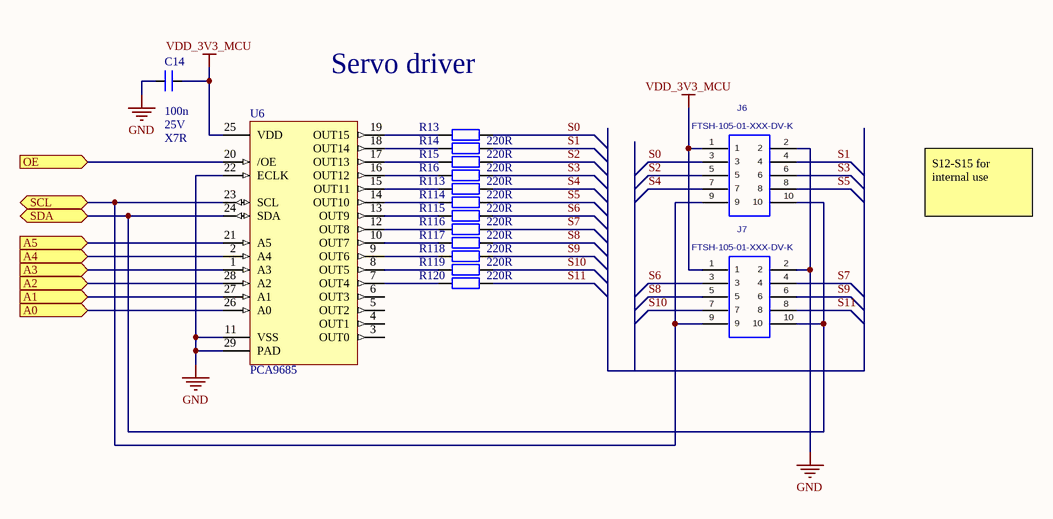
[diagram p3: servos.SchDoc]

### Parts
C14  value 100n  Voltage: 25V  Type: X7R  [C1005[0402]]  (hidden comment: cap)
J6  FTSH-105-01-XXX-DV-K  [FTSH-105-01-XXX-DV-K]
J7  FTSH-105-01-XXX-DV-K  [FTSH-105-01-XXX-DV-K]
R13  value 220R  [R1005[0402]]  (hidden comment: res)
R14  value 220R  [R1005[0402]]  (hidden comment: res)
R15  value 220R  [R1005[0402]]  (hidden comment: res)
R16  value 220R  [R1005[0402]]  (hidden comment: res)
R113  value 220R  [R1005[0402]]  (hidden comment: res)
R114  value 220R  [R1005[0402]]  (hidden comment: res)
R115  value 220R  [R1005[0402]]  (hidden comment: res)
R116  value 220R  [R1005[0402]]  (hidden comment: res)
R117  value 220R  [R1005[0402]]  (hidden comment: res)
R118  value 220R  [R1005[0402]]  (hidden comment: res)
R119  value 220R  [R1005[0402]]  (hidden comment: res)
R120  res  [R1005[0402]]  (value not drawn)
U6  PCA9685  [NXP_QFN65P600X600X100_HS-29M]

### Ports
A0 (in), A1 (in), A2 (in), A3 (in), A4 (in), A5 (in), OE (in), SCL (bidir), SDA (bidir)

### Nets
GND: C14.1 J6.2 J7.2 U6.11(VSS) U6.22(ECLK) U6.29(PAD)
VDD_3V3_MCU: C14.2 J6.1 J7.1 U6.25(VDD)
A0: U6.26(A0) ; port A0
A1: U6.27(A1) ; port A1
A2: U6.28(A2) ; port A2
A3: U6.1(A3) ; port A3
A4: U6.2(A4) ; port A4
A5: U6.21(A5) ; port A5
OE: U6.20(/OE) ; port OE
S0: J6.3 R13.2
S1: J6.4 R14.2
S2: J6.5 R15.2
S3: J6.6 R16.2
S4: J6.7 R113.2
S5: J6.8 R114.2
S6: J7.3 R115.2
S7: J7.4 R116.2
S8: J7.5 R117.2
S9: J7.6 R118.2
S10: J7.7 R119.2
S11: J7.8 R120.2
SCL: J6.9 J7.9 U6.23(SCL) ; port SCL
SDA: J6.10 J7.10 U6.24(SDA) ; port SDA
NetR13_1: R13.1 U6.19(OUT15)
NetR14_1: R14.1 U6.18(OUT14)
NetR15_1: R15.1 U6.17(OUT13)
NetR16_1: R16.1 U6.16(OUT12)
NetR113_1: R113.1 U6.15(OUT11)
NetR114_1: R114.1 U6.14(OUT10)
NetR115_1: R115.1 U6.13(OUT9)
NetR116_1: R116.1 U6.12(OUT8)
NetR117_1: R117.1 U6.10(OUT7)
NetR118_1: R118.1 U6.9(OUT6)
NetR119_1: R119.1 U6.8(OUT5)
NetR120_1: R120.1 U6.7(OUT4)

Not connected (* = marked no-connect by the designer): U6 3(OUT0) 4(OUT1) 5(OUT2) 6(OUT3)

### Channels
SR1: designators end in _SR1; ports A0=GND A1=VDD_3V3_MCU A2=VDD_3V3_MCU A3=GND A4=GND A5=GND OE=GND SCL=MCU_SCL SDA=MCU_SDA
SR2: designators end in _SR2; ports A0=VDD_3V3_MCU A1=VDD_3V3_MCU A2=VDD_3V3_MCU A3=GND A4=GND A5=GND OE=GND SCL=MCU_SCL SDA=MCU_SDA

### Notes on the sheet
- Servo driver
- S12-S15 for internal use
- Title
- Size:
- Date:
- A4
- Number:
- Time:
- Revision:
- Sheet
- of
- Repo:

### Library data of the parts
C14 = cap: Capacitor; Manufacturer: *; Series: *
J6 J7 = FTSH-105-01-XXX-DV-K: as J3 on sheet carrier; CREATED: November 30, 2016 - Wendy Xin; PCB DECAL: FTSH-105-01-XXX-DV-K
R13-R16 R113-R120 = res: Resistor; Tolerance: 5%

## Sheet front_raspicams.SchDoc: Camera
size A4; Organization: GPA Robotics; DocumentNumber: 6; Revision: REV 0; SheetNumber: 6; SheetTotal: 11
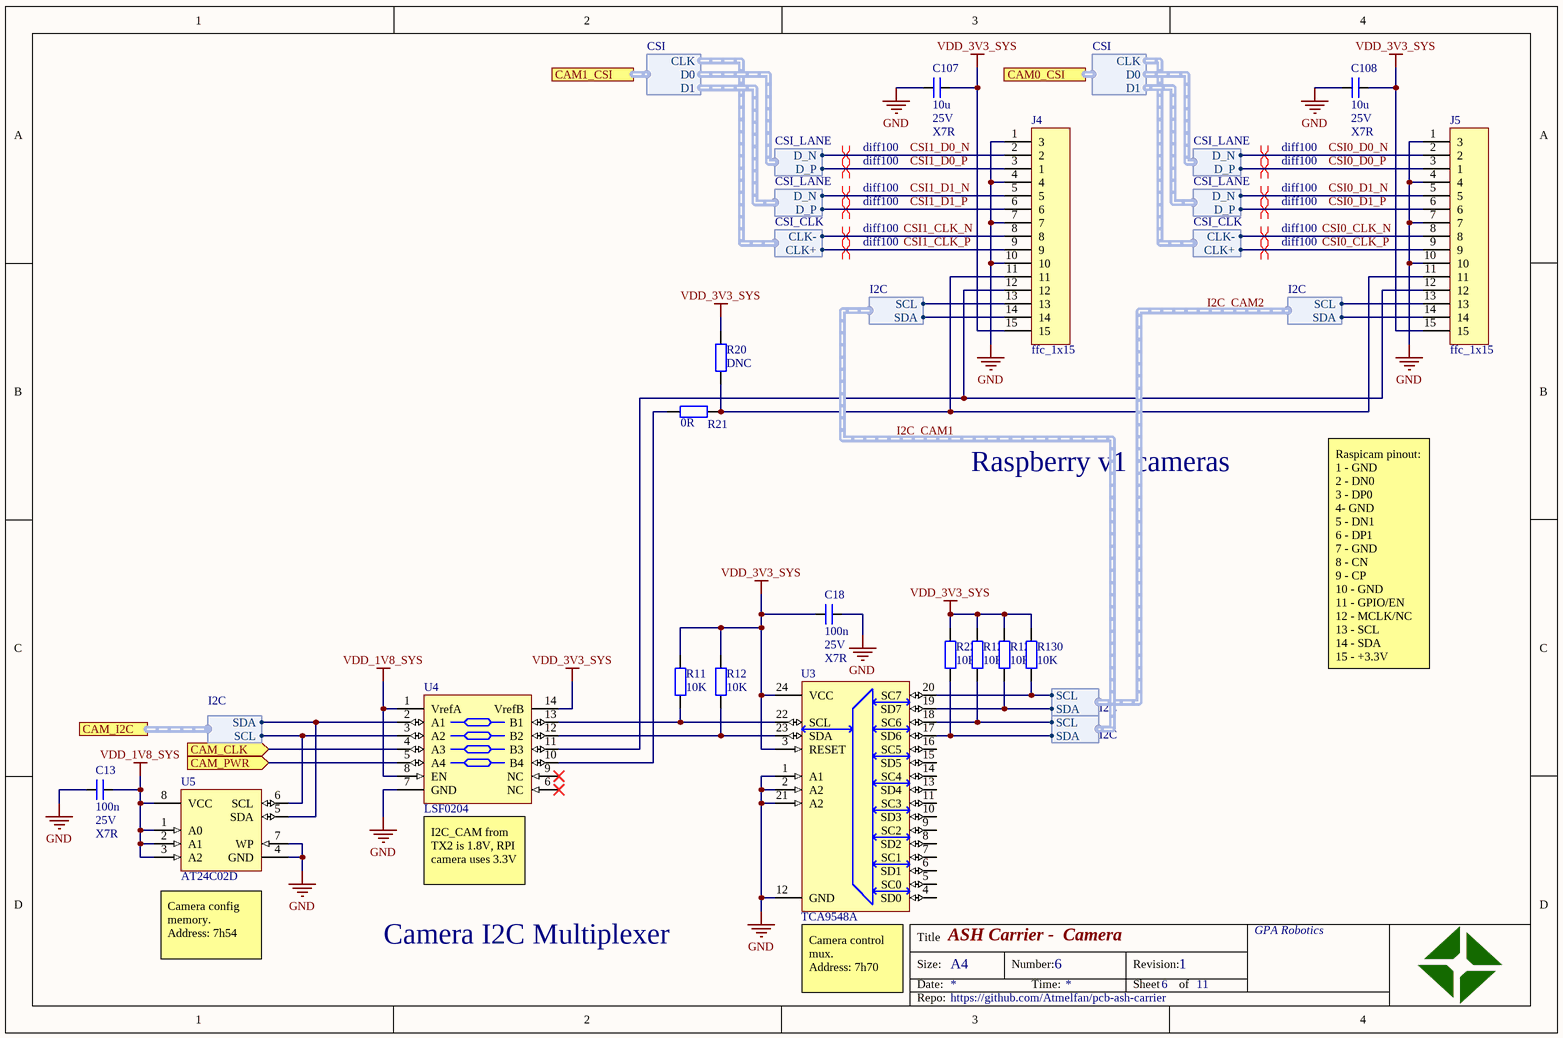
[diagram p4: front_raspicams.SchDoc]

### Parts
C13  value 100n  Voltage: 25V  Type: X7R  [C1005[0402]]  (hidden comment: cap)
C18  value 100n  Voltage: 25V  Type: X7R  [C1005[0402]]  (hidden comment: cap)
C107  value 10u  Voltage: 25V  Type: X7R  [C3216[1206]]  (hidden comment: cap)
C108  value 10u  Voltage: 25V  Type: X7R  [C3216[1206]]  (hidden comment: cap)
J4  ffc_1x15  [fci_ffc_1mm_1x15]
J5  ffc_1x15  [fci_ffc_1mm_1x15]
R11  value 10K  [R1005[0402]]  (hidden comment: res)
R12  value 10K  [R1005[0402]]  (hidden comment: res)
R20  value DNC  [R1005[0402]]  (hidden comment: res)
R21  value 0R  [R1005[0402]]  (hidden comment: res)
R22  value 10K  [R1005[0402]]  (hidden comment: res)
R128  value 10K  [R1005[0402]]  (hidden comment: res)
R129  value 10K  [R1005[0402]]  (hidden comment: res)
R130  value 10K  [R1005[0402]]  (hidden comment: res)
U3  TCA9548A  [TI_TSOP65P640X120-24N]
U4  LSF0204  [TI_TSOP65P640X120-14N]
U5  AT24C02D  [AT_TSOP65P640X120-8N]

### Ports
CAM0_CSI (harness CSI), CAM1_CSI (harness CSI), CAM_CLK (in), CAM_I2C (harness I2C), CAM_PWR (in)

### Harnesses
I2C: SCL, SDA
CSI: CLK, D0, D1
CSI_LANE: D_P, D_N
CSI_CLK: CLK-, CLK+

### Nets
GND: C13.2 C18.1 C107.2 C108.2 J4.1(3) J4.4 J4.7 J4.10 J5.1(3) J5.4 J5.7 J5.10 U3.1(A1) U3.2(A2) U3.12(GND) U3.21(A2) U4.7(GND) U5.4(GND) U5.7(WP)
VDD_1V8_SYS: C13.1 U4.1(VrefA) U4.8(EN) U5.1(A0) U5.2(A1) U5.3(A2) U5.8(VCC)
VDD_3V3_SYS: C18.2 C107.1 C108.1 J4.15 J5.15 R11.2 R12.2 R20.1 R22.2 R128.2 R129.2 R130.2 U3.3(RESET) U3.24(VCC) U4.14(VrefB)
CSI0_CLK_N: J5.8 ; harness CSI_CLK.CLK-
CSI0_CLK_P: J5.9 ; harness CSI_CLK.CLK+
CSI0_D0_N: J5.2 ; harness CSI_LANE.D_N
CSI0_D0_P: J5.3(1) ; harness CSI_LANE.D_P
CSI0_D1_N: J5.5 ; harness CSI_LANE.D_N
CSI0_D1_P: J5.6 ; harness CSI_LANE.D_P
CSI1_CLK_N: J4.8 ; harness CSI_CLK.CLK-
CSI1_CLK_P: J4.9 ; harness CSI_CLK.CLK+
CSI1_D0_N: J4.2 ; harness CSI_LANE.D_N
CSI1_D0_P: J4.3(1) ; harness CSI_LANE.D_P
CSI1_D1_N: J4.5 ; harness CSI_LANE.D_N
CSI1_D1_P: J4.6 ; harness CSI_LANE.D_P
I2C_CAM1.SCL: J4.13 R128.1 U3.18(SC6) ; harness I2C.SCL
I2C_CAM1.SDA: J4.14 R22.1 U3.17(SD6) ; harness I2C.SDA
I2C_CAM2.SCL: J5.13 R130.1 U3.20(SC7) ; harness I2C.SCL
I2C_CAM2.SDA: J5.14 R129.1 U3.19(SD7) ; harness I2C.SDA
NetJ1_C6: U4.3(A2) U5.6(SCL) ; port CAM_I2C.SCL
NetJ1_D6: U4.2(A1) U5.5(SDA) ; port CAM_I2C.SDA
NetJ1_F9: U4.4(A3) ; port CAM_CLK
NetJ1_G8: U4.5(A4) ; port CAM_PWR
NetJ4_11: J4.11 J5.11 R20.2 R21.1
NetJ4_12: J4.12 J5.12 U4.11(B3)
NetR11_1: R11.1 U3.22(SCL) U4.13(B1)
NetR12_1: R12.1 U3.23(SDA) U4.12(B2)
NetR21_2: R21.2 U4.10(B4)

Not connected (* = marked no-connect by the designer): U3 4(SD0) 5(SC0) 6(SD1) 7(SC1) 8(SD2) 9(SC2) 10(SD3) 11(SC3) 13(SD4) 14(SC4) 15(SD5) 16(SC5); U4 6(NC)* 9(NC)*

### Layout directives
differential pair; net class diff100: CSI0_CLK_N, CSI0_CLK_P, CSI0_D0_N, CSI0_D0_P, CSI0_D1_N, CSI0_D1_P, CSI1_CLK_N, CSI1_CLK_P, CSI1_D0_N, CSI1_D0_P, CSI1_D1_N, CSI1_D1_P

### Notes on the sheet
- Raspberry v1 cameras
- Raspicam pinout:
  1 - GND
  2 - DN0
  3 - DP0
  4- GND
  5 - DN1
  6 - DP1
  7 - GND
  8 - CN
  9 - CP
  10 - GND
  11 - GPIO/EN
  12 - MCLK/NC
  13 - SCL
  14 - SDA
  15 - +3.3V
- (near U4) I2C_CAM from TX2 is 1.8V, RPI camera uses 3.3V
- (near U5) Camera config memory.
  Address: 7h54
- Camera I2C Multiplexer
- (near U3) Camera control mux.
  Address: 7h70
- Title
- Size:
- Date:
- A4
- Number:
- Time:
- Revision:
- Sheet
- of
- Repo:

### Library data of the parts
C13 C18 C107 C108 = cap: Capacitor; Manufacturer: *; Series: *
R11 R12 R20 R21 = res: Resistor
R22 R128-R130 = res: Resistor; Tolerance: 5%

## Sheet psu_and_discharge.SchDoc: PSU:s
size A3; Organization: GPA Robotics; DocumentNumber: 7; Revision: REV 0; SheetNumber: 7; SheetTotal: 11
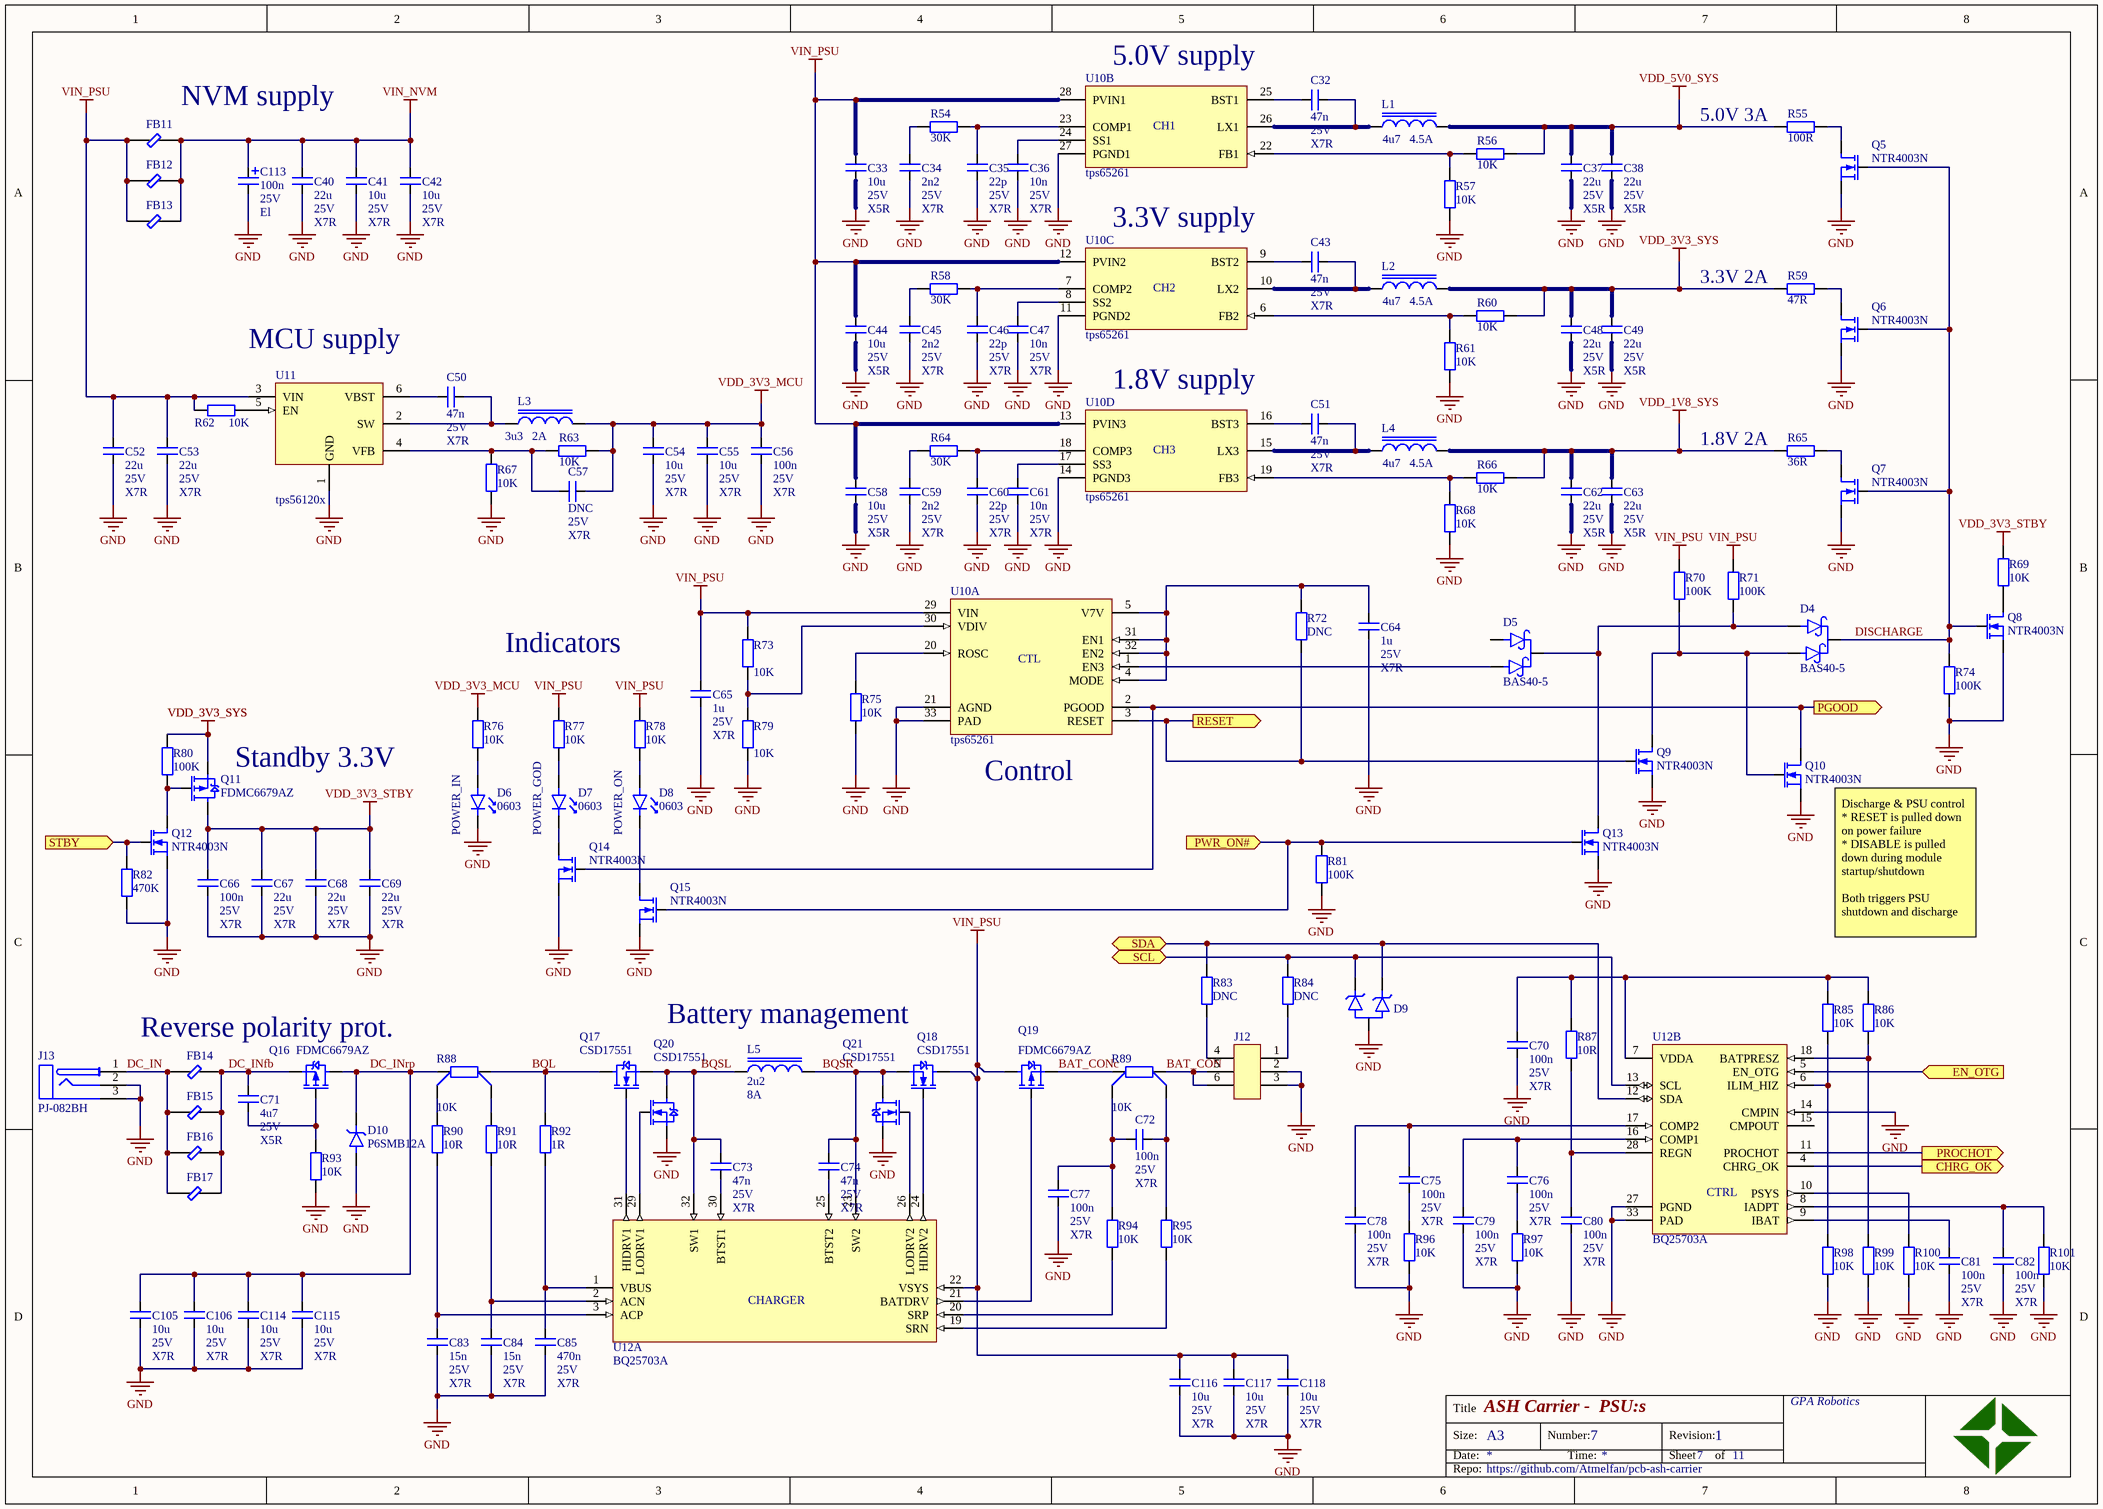
[diagram p5: psu_and_discharge.SchDoc]

### Parts
C32  value 47n  Voltage: 25V  Type: X7R  [C1005[0402]]  (hidden comment: cap)
C33  value 10u  Voltage: 25V  Type: X5R  [C3216[1206]]  (hidden comment: cap)
C34  value 2n2  Voltage: 25V  Type: X7R  [C1005[0402]]  (hidden comment: cap)
C35  value 22p  Voltage: 25V  Type: X7R  [C1005[0402]]  (hidden comment: cap)
C36  value 10n  Voltage: 25V  Type: X7R  [C1005[0402]]  (hidden comment: cap)
C37  value 22u  Voltage: 25V  Type: X5R  [C3216[1206]]  (hidden comment: cap)
C38  value 22u  Voltage: 25V  Type: X5R  [C3216[1206]]  (hidden comment: cap)
C40  value 22u  Voltage: 25V  Type: X7R  [C3216[1206]]  (hidden comment: cap)
C41  value 10u  Voltage: 25V  Type: X7R  [C3216[1206]]  (hidden comment: cap)
C42  value 10u  Voltage: 25V  Type: X7R  [C3216[1206]]  (hidden comment: cap)
C43  value 47n  Voltage: 25V  Type: X7R  [C1005[0402]]  (hidden comment: cap)
C44  value 10u  Voltage: 25V  Type: X5R  [C3216[1206]]  (hidden comment: cap)
C45  value 2n2  Voltage: 25V  Type: X7R  [C1005[0402]]  (hidden comment: cap)
C46  value 22p  Voltage: 25V  Type: X7R  [C1005[0402]]  (hidden comment: cap)
C47  value 10n  Voltage: 25V  Type: X7R  [C1005[0402]]  (hidden comment: cap)
C48  value 22u  Voltage: 25V  Type: X5R  [C3216[1206]]  (hidden comment: cap)
C49  value 22u  Voltage: 25V  Type: X5R  [C3216[1206]]  (hidden comment: cap)
C50  value 47n  Voltage: 25V  Type: X7R  [C1005[0402]]  (hidden comment: cap)
C51  value 47n  Voltage: 25V  Type: X7R  [C1005[0402]]  (hidden comment: cap)
C52  value 22u  Voltage: 25V  Type: X7R  [C3216[1206]]  (hidden comment: cap)
C53  value 22u  Voltage: 25V  Type: X7R  [C3216[1206]]  (hidden comment: cap)
C54  value 10u  Voltage: 25V  Type: X7R  [C3216[1206]]  (hidden comment: cap)
C55  value 10u  Voltage: 25V  Type: X7R  [C3216[1206]]  (hidden comment: cap)
C56  value 100n  Voltage: 25V  Type: X7R  [C1005[0402]]  (hidden comment: cap)
C57  value DNC  Voltage: 25V  Type: X7R  [C1005[0402]]  (hidden comment: cap)
C58  value 10u  Voltage: 25V  Type: X5R  [C3216[1206]]  (hidden comment: cap)
C59  value 2n2  Voltage: 25V  Type: X7R  [C1005[0402]]  (hidden comment: cap)
C60  value 22p  Voltage: 25V  Type: X7R  [C1005[0402]]  (hidden comment: cap)
C61  value 10n  Voltage: 25V  Type: X7R  [C1005[0402]]  (hidden comment: cap)
C62  value 22u  Voltage: 25V  Type: X5R  [C3216[1206]]  (hidden comment: cap)
C63  value 22u  Voltage: 25V  Type: X5R  [C3216[1206]]  (hidden comment: cap)
C64  value 1u  Voltage: 25V  Type: X7R  [C2012[0805]]  (hidden comment: cap)
C65  value 1u  Voltage: 25V  Type: X7R  [C2012[0805]]  (hidden comment: cap)
C66  value 100n  Voltage: 25V  Type: X7R  [C1005[0402]]  (hidden comment: cap)
C67  value 22u  Voltage: 25V  Type: X7R  [C3216[1206]]  (hidden comment: cap)
C68  value 22u  Voltage: 25V  Type: X7R  [C3216[1206]]  (hidden comment: cap)
C69  value 22u  Voltage: 25V  Type: X7R  [C3216[1206]]  (hidden comment: cap)
C70  value 100n  Voltage: 25V  Type: X7R  [C1005[0402]]  (hidden comment: cap)
C71  value 4u7  Voltage: 25V  Type: X5R  [C1005[0402]]  (hidden comment: cap)
C72  value 100n  Voltage: 25V  Type: X7R  [C1005[0402]]  (hidden comment: cap)
C73  value 47n  Voltage: 25V  Type: X7R  [C1005[0402]]  (hidden comment: cap)
C74  value 47n  Voltage: 25V  Type: X7R  [C1005[0402]]  (hidden comment: cap)
C75  value 100n  Voltage: 25V  Type: X7R  [C1005[0402]]  (hidden comment: cap)
C76  value 100n  Voltage: 25V  Type: X7R  [C1005[0402]]  (hidden comment: cap)
C77  value 100n  Voltage: 25V  Type: X7R  [C1005[0402]]  (hidden comment: cap)
C78  value 100n  Voltage: 25V  Type: X7R  [C1005[0402]]  (hidden comment: cap)
C79  value 100n  Voltage: 25V  Type: X7R  [C1005[0402]]  (hidden comment: cap)
C80  value 100n  Voltage: 25V  Type: X7R  [C1005[0402]]  (hidden comment: cap)
C81  value 100n  Voltage: 25V  Type: X7R  [C1005[0402]]  (hidden comment: cap)
C82  value 100n  Voltage: 25V  Type: X7R  [C1005[0402]]  (hidden comment: cap)
C83  value 15n  Voltage: 25V  Type: X7R  [C1005[0402]]  (hidden comment: cap)
C84  value 15n  Voltage: 25V  Type: X7R  [C1005[0402]]  (hidden comment: cap)
C85  value 470n  Voltage: 25V  Type: X7R  [C1005[0402]]  (hidden comment: cap)
C105  value 10u  Voltage: 25V  Type: X7R  [C3216[1206]]  (hidden comment: cap)
C106  value 10u  Voltage: 25V  Type: X7R  [C3216[1206]]  (hidden comment: cap)
C113  value 100n  Voltage: 25V  Type: El  [CAPAE7366X55M]  (hidden comment: pcap)
C114  value 10u  Voltage: 25V  Type: X7R  [C3216[1206]]  (hidden comment: cap)
C115  value 10u  Voltage: 25V  Type: X7R  [C3216[1206]]  (hidden comment: cap)
C116  value 10u  Voltage: 25V  Type: X7R  [C3216[1206]]  (hidden comment: cap)
C117  value 10u  Voltage: 25V  Type: X7R  [C3216[1206]]  (hidden comment: cap)
C118  value 10u  Voltage: 25V  Type: X7R  [C3216[1206]]  (hidden comment: cap)
D4  BAS40-5  [DCC_SOT95P235X110-3N]
D5  BAS40-5  [DCC_SOT95P235X110-3N]
D6  0603  [LEDC1608X06N]
D7  0603  [LEDC1608X06N]
D8  0603  [LEDC1608X06N]
D9  Zener  [DCA_SOT95P235X110-3N]  (value not drawn)
D10  P6SMB12A  [SMA_DIOM5226X22N]
FB11  2506036007Y3  [FBC1608X07N]  (value not drawn)
FB12  2506036007Y3  [FBC1608X07N]  (value not drawn)
FB13  2506036007Y3  [FBC1608X07N]  (value not drawn)
FB14  2506036007Y3  [FBC1608X07N]  (value not drawn)
FB15  2506036007Y3  [FBC1608X07N]  (value not drawn)
FB16  2506036007Y3  [FBC1608X07N]  (value not drawn)
FB17  2506036007Y3  [FBC1608X07N]  (value not drawn)
J12  43045-0600  [molex_microfit_2x6_90deg]  (value not drawn)
J13  PJ-082BH  [CUI_DC_5.5MM_PJ028]
L1  value 4u7  Current: 4.5A  [BOURNS_SRN6045TA-XXX]  (hidden comment: ASPI-0630LR-XXXM-T15)
L2  value 4u7  Current: 4.5A  [BOURNS_SRN6045TA-XXX]  (hidden comment: ASPI-0630LR-XXXM-T15)
L3  value 3u3  Current: 2A  [YUDEN_NRS4018T-XXXMDGJ]  (hidden comment: ASPI-0630LR-XXXM-T15)
L4  value 4u7  Current: 4.5A  [BOURNS_SRN6045TA-XXX]  (hidden comment: ASPI-0630LR-XXXM-T15)
L5  value 2u2  Current: 8A  [VISHAY_IHLM2525CZERXXXM01]  (hidden comment: ASPI-0630LR-XXXM-T15)
Q5  NTR4003N  [NCH_SOT95P237X110-3N]
Q6  NTR4003N  [NCH_SOT95P237X110-3N]
Q7  NTR4003N  [NCH_SOT95P237X110-3N]
Q8  NTR4003N  [NCH_SOT95P237X110-3N]
Q9  NTR4003N  [NCH_SOT95P237X110-3N]
Q10  NTR4003N  [NCH_SOT95P237X110-3N]
Q11  FDMC6679AZ  [NCH_SON65P330X80_HS-9N]
Q12  NTR4003N  [NCH_SOT95P237X110-3N]
Q13  NTR4003N  [NCH_SOT95P237X110-3N]
Q14  NTR4003N  [NCH_SOT95P237X110-3N]
Q15  NTR4003N  [NCH_SOT95P237X110-3N]
Q16  FDMC6679AZ  [NCH_SON65P330X80_HS-9N]
Q17  CSD17551  [NCH_SON65P330X80_HS-9N]
Q18  CSD17551  [NCH_SON65P330X80_HS-9N]
Q19  FDMC6679AZ  [NCH_SON65P330X80_HS-9N]
Q20  CSD17551  [NCH_SON65P330X80_HS-9N]
Q21  CSD17551  [NCH_SON65P330X80_HS-9N]
R54  value 30K  [R1005[0402]]  (hidden comment: res)
R55  value 100R  [R1005[0402]]  (hidden comment: res)
R56  value 10K  [R1005[0402]]  (hidden comment: res)
R57  value 10K  [R1005[0402]]  (hidden comment: res)
R58  value 30K  [R1005[0402]]  (hidden comment: res)
R59  value 47R  [R1005[0402]]  (hidden comment: res)
R60  value 10K  [R1005[0402]]  (hidden comment: res)
R61  value 10K  [R1005[0402]]  (hidden comment: res)
R62  value 10K  [R1005[0402]]  (hidden comment: res)
R63  value 10K  [R1005[0402]]  (hidden comment: res)
R64  value 30K  [R1005[0402]]  (hidden comment: res)
R65  value 36R  [R1005[0402]]  (hidden comment: res)
R66  value 10K  [R1005[0402]]  (hidden comment: res)
R67  value 10K  [R1005[0402]]  (hidden comment: res)
R68  value 10K  [R1005[0402]]  (hidden comment: res)
R69  value 10K  [R1005[0402]]  (hidden comment: res)
R70  value 100K  [R1005[0402]]  (hidden comment: res)
R71  value 100K  [R1005[0402]]  (hidden comment: res)
R72  value DNC  [R1005[0402]]  (hidden comment: res)
R73  value 10K  [R1005[0402]]  (hidden comment: res)
R74  value 100K  [R1005[0402]]  (hidden comment: res)
R75  value 10K  [R1005[0402]]  (hidden comment: res)
R76  value 10K  [R1005[0402]]  (hidden comment: res)
R77  value 10K  [R1005[0402]]  (hidden comment: res)
R78  value 10K  [R1005[0402]]  (hidden comment: res)
R79  value 10K  [R1005[0402]]  (hidden comment: res)
R80  value 100K  [R1005[0402]]  (hidden comment: res)
R81  value 100K  [R1005[0402]]  (hidden comment: res)
R82  value 470K  [R1005[0402]]  (hidden comment: res)
R83  value DNC  [R1005[0402]]  (hidden comment: res)
R84  value DNC  [R1005[0402]]  (hidden comment: res)
R85  value 10K  [R1005[0402]]  (hidden comment: res)
R86  value 10K  [R1005[0402]]  (hidden comment: res)
R87  value 10R  [R1005[0402]]  (hidden comment: res)
R88  value 10K  [4W_R320P320X90-4N]  (hidden comment: res_sens)
R89  value 10K  [4W_R320P320X90-4N]  (hidden comment: res_sens)
R90  value 10R  [R1005[0402]]  (hidden comment: res)
R91  value 10R  [R1005[0402]]  (hidden comment: res)
R92  value 1R  [R1005[0402]]  (hidden comment: res)
R93  value 10K  [R1005[0402]]  (hidden comment: res)
R94  value 10K  [R1005[0402]]  (hidden comment: res)
R95  value 10K  [R1005[0402]]  (hidden comment: res)
R96  value 10K  [R1005[0402]]  (hidden comment: res)
R97  value 10K  [R1005[0402]]  (hidden comment: res)
R98  value 10K  [R1005[0402]]  (hidden comment: res)
R99  value 10K  [R1005[0402]]  (hidden comment: res)
R100  value 10K  [R1005[0402]]  (hidden comment: res)
R101  value 10K  [R1005[0402]]  (hidden comment: res)
U10  tps65261  [TI_QFN50P500X500X100_HS-33M]  (parts A,B,C,D of 4)
U11  tps56120x  [TI_SOT95P280X110-6N]
U12  BQ25703A  [TI_QFN40P400X400X80_HS-33M]  (parts A,B of 2)

### Ports
CHRG_OK (out), EN_OTG (in), PGOOD (out), PROCHOT (out), PWR_ON# (in), RESET (out), SCL (bidir), SDA (bidir), STBY (in)

### Nets
GND: C33.1 C34.1 C35.1 C36.1 C37.1 C38.1 C40.1 C41.1 C42.1 C44.1 C45.1 C46.1 C47.1 C48.1 C49.1 C52.1 C53.1 C54.1 C55.1 C56.1 C58.1 C59.1 C60.1 C61.1 C62.1 C63.1 C64.1 C65.1 C66.1 C67.1 C68.1 C69.1 C70.1 C77.2 C78.2 C79.2 C80.2 C81.1 C82.1 C83.1 C84.1 C85.1 C105.1 C106.1 C113.2 C114.1 C115.1 C116.1 C117.1 C118.1 D6.C D9.A D10.A J12.2 J12.3 J13.2 J13.3 Q5.S Q6.S Q7.S Q8.S Q9.S Q10.S Q12.S Q13.S Q14.S Q15.S Q20.S Q21.S R57.2 R61.2 R67.1 R68.2 R74.1 R75.1 R79.1 R81.2 R82.1 R93.1 R96.1 R97.1 R98.2 R99.2 R100.1 R101.1 U10.11(PGND2) U10.14(PGND3) U10.21(AGND) U10.27(PGND1) U10.33(PAD) U11.1(GND) U12.14(CMPIN) U12.27(PGND) U12.33(PAD)
VDD_1V8_SYS: C62.2 C63.2 L4.2 R65.1 R66.1
VDD_3V3_MCU: C54.2 C55.2 C56.2 C57.1 L3.2 R63.2 R76.2
VDD_3V3_STBY: C66.2 C67.2 C68.2 C69.2 Q11.D R69.2
VDD_3V3_SYS: C48.2 C49.2 L2.2 Q11.S R59.1 R60.1 R80.2
VDD_5V0_SYS: C37.2 C38.2 L1.2 R55.1 R56.1
VIN_NVM: C40.2 C41.2 C42.2 C113.1 FB11.2 FB12.2 FB13.2
VIN_PSU: C33.2 C44.2 C52.2 C53.2 C58.2 C65.2 C116.2 C117.2 C118.2 FB11.1 FB12.1 FB13.1 Q18.D Q19.D R62.1 R70.1 R71.1 R73.2 R77.2 R78.2 U10.12(PVIN2) U10.13(PVIN3) U10.28(PVIN1) U10.29(VIN) U11.3(VIN) U12.22(VSYS)
BAT_CON: J12.5 J12.6 R89.2
BAT_CONc: Q19.S R89.1
BQL: Q17.D R88.1 R92.2
BQSL: C73.2 L5.1 Q17.S Q20.D U12.32(SW1)
BQSR: C74.2 L5.2 Q18.S Q21.D U12.23(SW2)
CHRG_OK: U12.4(CHRG_OK) ; port CHRG_OK
DC_IN: FB14.1 FB15.1 FB16.1 FB17.1 J13.1
DC_INfb: C71.2 FB14.2 FB15.2 FB16.2 FB17.2 Q16.S
DC_INrp: C105.2 C106.2 C114.2 C115.2 D10.C Q16.D R88.2
DISCHARGE: D4.C Q5.G Q6.G Q7.G Q8.G R74.2
EN_OTG: U12.5(EN_OTG) ; port EN_OTG
MCU_SCL: D9.C2 R84.1 U12.13(SCL) ; port SCL
MCU_SDA: D9.C1 R83.1 U12.12(SDA) ; port SDA
PROCHOT: U12.11(PROCHOT) ; port PROCHOT
NetC32_1: C32.1 L1.1 U10.26(LX1)
NetC32_2: C32.2 U10.25(BST1)
NetC34_2: C34.2 R54.1
NetC35_2: C35.2 R54.2 U10.23(COMP1)
NetC36_2: C36.2 U10.24(SS1)
NetC43_1: C43.1 L2.1 U10.10(LX2)
NetC43_2: C43.2 U10.9(BST2)
NetC45_2: C45.2 R58.1
NetC46_2: C46.2 R58.2 U10.7(COMP2)
NetC47_2: C47.2 U10.8(SS2)
NetC50_1: C50.1 L3.1 U11.2(SW)
NetC50_2: C50.2 U11.6(VBST)
NetC51_1: C51.1 L4.1 U10.15(LX3)
NetC51_2: C51.2 U10.16(BST3)
NetC57_2: C57.2 R63.1 R67.2 U11.4(VFB)
NetC59_2: C59.2 R64.1
NetC60_2: C60.2 R64.2 U10.18(COMP3)
NetC61_2: C61.2 U10.17(SS3)
NetC64_2: C64.2 R72.1 U10.4(MODE) U10.5(V7V) U10.31(EN1) U10.32(EN2)
NetC70_2: C70.2 R85.1 R86.1 R87.2 U12.7(VDDA)
NetC71_1: C71.1 Q16.G R93.2
NetC72_1: C72.1 R89.S2 R95.2
NetC72_2: C72.2 C77.1 R89.S1 R94.2
NetC73_1: C73.1 U12.30(BTST1)
NetC74_1: C74.1 U12.25(BTST2)
NetC75_1: C75.1 C78.1 U12.17(COMP2)
NetC75_2: C75.2 R96.2
NetC76_1: C76.1 C79.1 U12.16(COMP1)
NetC76_2: C76.2 R97.2
NetC80_1: C80.1 R87.1 U12.28(REGN)
NetC81_2: C81.2 U12.9(IBAT)
NetC82_2: C82.2 R101.2 U12.8(IADPT)
NetC83_2: C83.2 R90.1 U12.3(ACP)
NetC84_2: C84.2 R91.1 U12.2(ACN)
NetC85_2: C85.2 R92.1 U12.1(VBUS)
NetD4_A1: D4.A1 D5.C Q13.D R71.2
NetD4_A2: D4.A2 Q9.D Q10.G R70.2
NetD5_A2: D5.A2 U10.1(EN3)
NetD6_A: D6.A R76.1
NetD7_A: D7.A R77.1
NetD7_C: D7.C Q14.D
NetD8_A: D8.A R78.1
NetD8_C: D8.C Q15.D
NetJ1_B7: Q12.G R82.2 ; port STBY
NetJ12_1: J12.1 R84.2
NetJ12_4: J12.4 R83.2
NetQ5_D: Q5.D R55.2
NetQ6_D: Q6.D R59.2
NetQ7_D: Q7.D R65.2
NetQ8_D: Q8.D R69.1
NetQ9_G: Q9.G R72.2 U10.3(RESET) ; port RESET
NetQ10_D: Q10.D Q14.G U10.2(PGOOD) ; port PGOOD
NetQ11_G: Q11.G Q12.D R80.1
NetQ13_G: Q13.G Q15.G R81.1 ; port PWR_ON#
NetQ17_G: Q17.G U12.31(HIDRV1)
NetQ18_G: Q18.G U12.24(HIDRV2)
NetQ19_G: Q19.G U12.21(BATDRV)
NetQ20_G: Q20.G U12.29(LODRV1)
NetQ21_G: Q21.G U12.26(LODRV2)
NetR56_2: R56.2 R57.1 U10.22(FB1)
NetR60_2: R60.2 R61.1 U10.6(FB2)
NetR62_2: R62.2 U11.5(EN)
NetR66_2: R66.2 R68.1 U10.19(FB3)
NetR73_1: R73.1 R79.2 U10.30(VDIV)
NetR75_2: R75.2 U10.20(ROSC)
NetR85_2: R85.2 R98.1 U12.6(ILIM_HIZ)
NetR86_2: R86.2 R99.1 U12.18(BATPRESZ)
NetR88_S1: R88.S1 R91.2
NetR88_S2: R88.S2 R90.2
NetR94_1: R94.1 U12.20(SRP)
NetR95_1: R95.1 U12.19(SRN)
NetR100_2: R100.2 U12.10(PSYS)

Not connected (* = marked no-connect by the designer): D5 A1; U12 15(CMPOUT)

### Notes on the sheet
- (near FB11) NVM supply
- (near U10) 5.0V supply
- (near R55) 5.0V 3A
- (near U10) 3.3V supply
- (near R59) 3.3V 2A
- MCU supply
- (near U10) 1.8V supply
- (near R65) 1.8V 2A
- Indicators
- (near Q11) Standby 3.3V
- (near U10) Control
- (near D6) POWER_IN
- (near D7) POWER_GOD
- (near D8) POWER_ON
- (near Q10) Discharge & PSU control
  * RESET is pulled down on power failure
  * DISABLE is pulled down during module startup/shutdown
  Both triggers PSU shutdown and discharge
- Reverse polarity prot.
- Battery management
- Title
- Size:
- Date:
- A3
- Number:
- Time:
- Revision:
- Sheet
- of
- Repo:
- (in symbol bq25703a, part A) CHARGER
- (in symbol bq25703a, part B) CTRL
- (in symbol tps65261, part A) CTL
- (in symbol tps65261, part B) CH1
- (in symbol tps65261, part C) CH2
- (in symbol tps65261, part D) CH3

### Library data of the parts
C32-C38 C40-C85 C105 C106 C114-C118 = cap: Capacitor; Manufacturer: *; Series: *
C113 = pcap: Polarized capacitor; Manufacturer: *; Series: *
D4 D5 = diode_dual_cc
D6-D8 = diode_led
D9 = diode_dual_ca_zener: Voltage: 3.6V
D10 = diode_tvs_unidirectional
FB11-FB17 = ferrite_bead: Ferrite bead
J12 = microfit_2x3
J13 = dc_jack_shielded: mouser#: 490-PJ-082BH; digikey#: CP-082BHCT-ND
L1-L5 = ind
Q5-Q10 Q12-Q15 = nch_mosfet
Q11 Q16 Q19 = pch_mosfet_diode
Q17 Q18 Q20 Q21 = nch_mosfet_diode
R54-R87 R90-R101 = res: Resistor
R88 R89 = res_sens: Resistor

## Sheet usb_connectors.SchDoc: USB ports
size A4; Organization: GPA Robotics; DocumentNumber: 8; Revision: REV 0; SheetNumber: 8; SheetTotal: 11
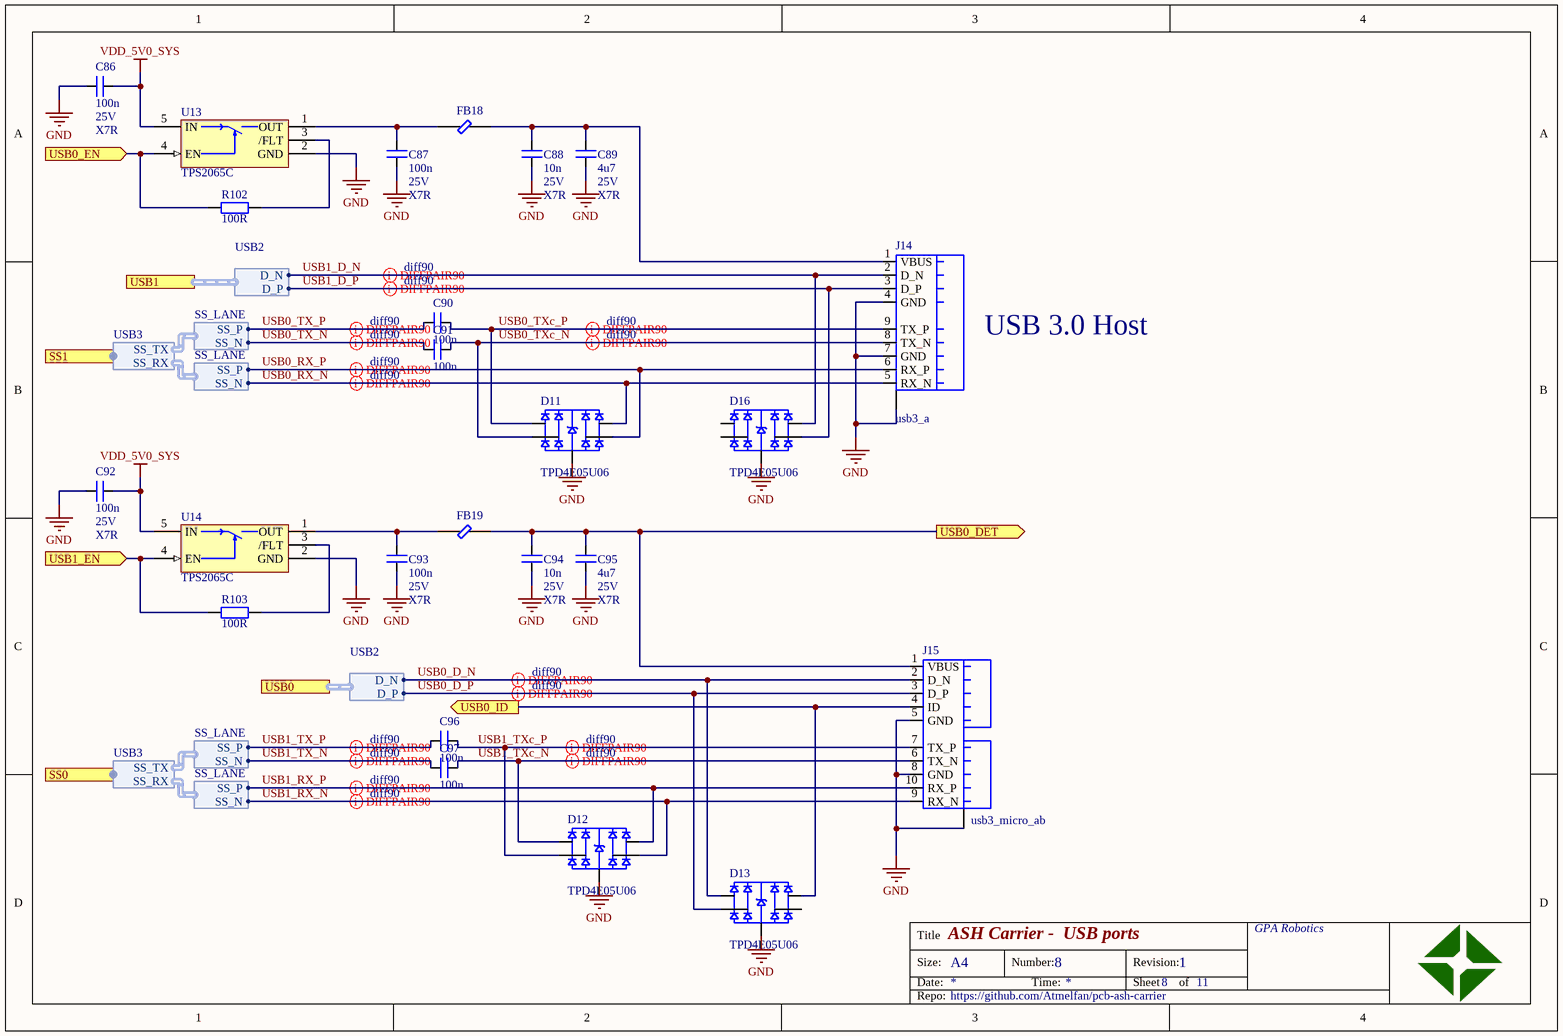
[diagram p6: usb_connectors.SchDoc]

### Parts
C86  value 100n  Voltage: 25V  Type: X7R  [C1005[0402]]  (hidden comment: cap)
C87  value 100n  Voltage: 25V  Type: X7R  [C1005[0402]]  (hidden comment: cap)
C88  value 10n  Voltage: 25V  Type: X7R  [C1005[0402]]  (hidden comment: cap)
C89  value 4u7  Voltage: 25V  Type: X7R  [C3216[1206]]  (hidden comment: cap)
C90  value 100n  [C1005[0402]]  (hidden comment: cap)
C91  value 100n  [C1005[0402]]  (hidden comment: cap)
C92  value 100n  Voltage: 25V  Type: X7R  [C1005[0402]]  (hidden comment: cap)
C93  value 100n  Voltage: 25V  Type: X7R  [C1005[0402]]  (hidden comment: cap)
C94  value 10n  Voltage: 25V  Type: X7R  [C1005[0402]]  (hidden comment: cap)
C95  value 4u7  Voltage: 25V  Type: X7R  [C3216[1206]]  (hidden comment: cap)
C96  value 100n  [C1005[0402]]  (hidden comment: cap)
C97  value 100n  [C1005[0402]]  (hidden comment: cap)
D11  TPD4E05U06  [TI_PSON50P100X55-10N]
D12  TPD4E05U06  [TI_PSON50P100X55-10N]
D13  TPD4E05U06  [TI_PSON50P100X55-10N]
D16  TPD4E05U06  [TI_PSON50P100X55-10N]
FB18  2506036007Y3  [FBC1608X07N]  (value not drawn)
FB19  2506036007Y3  [FBC1608X07N]  (value not drawn)
J14  usb3_a  [usb3_a]
J15  usb3_micro_ab  [usb3_micro_ab]
R102  value 100R  [R1005[0402]]  (hidden comment: res)
R103  value 100R  [R1005[0402]]  (hidden comment: res)
U13  TPS2065C  [TI_SOT95P280X145-5N]
U14  TPS2065C  [TI_SOT95P280X145-5N]

### Ports
SS0 (harness USB3), SS1 (harness USB3), USB0 (harness USB2), USB0_DET (out), USB0_EN (in), USB0_ID (out), USB1 (harness USB2), USB1_EN (in)

### Harnesses
USB2: D_P, D_N
USB3: SS_TX, SS_RX
SS_LANE: SS_P, SS_N

### Nets
GND: C86.2 C87.1 C88.1 C89.1 C92.2 C93.1 C94.1 C95.1 D11.3(GND) D12.3(GND) D13.3(GND) D16.3(GND) J14.4(GND) J14.7(GND) J14.SHIELD J15.5(GND) J15.8(GND) J15.SHIELD U13.2(GND) U14.2(GND)
VDD_5V0_SYS: C86.1 C92.1 U13.5(IN) U14.5(IN)
USB0_D_N: D13.1(D1+) J15.2(D_N) ; port USB0.D_N
USB0_D_P: D13.2(D1-) J15.3(D_P) ; port USB0.D_P
USB0_RX_N: D11.5(D2+) J14.5(RX_N) ; harness SS_LANE.SS_N
USB0_RX_P: D11.4(D2-) J14.6(RX_P) ; harness SS_LANE.SS_P
USB0_TX_N: C91.2 ; harness SS_LANE.SS_N
USB0_TX_P: C90.2 ; harness SS_LANE.SS_P
USB0_TXc_N: C91.1 D11.2(D1-) J14.8(TX_N)
USB0_TXc_P: C90.1 D11.1(D1+) J14.9(TX_P)
USB1_D_N: D16.5(D2+) J14.2(D_N) ; port USB1.D_N
USB1_D_P: D16.4(D2-) J14.3(D_P) ; port USB1.D_P
USB1_RX_N: D12.4(D2-) J15.9(RX_N) ; harness SS_LANE.SS_N
USB1_RX_P: D12.5(D2+) J15.10(RX_P) ; harness SS_LANE.SS_P
USB1_TX_N: C97.2 ; harness SS_LANE.SS_N
USB1_TX_P: C96.2 ; harness SS_LANE.SS_P
USB1_TXc_N: C97.1 D12.1(D1+) J15.6(TX_N)
USB1_TXc_P: C96.1 D12.2(D1-) J15.7(TX_P)
NetC87_2: C87.2 FB18.1 U13.1(OUT)
NetC88_2: C88.2 C89.2 FB18.2 J14.1(VBUS)
NetC93_2: C93.2 FB19.1 U14.1(OUT)
NetC94_2: C94.2 C95.2 FB19.2 J15.1(VBUS) ; port USB0_DET
NetD13_5: D13.5(D2+) J15.4(ID) ; port USB0_ID
NetJ1_A17: R102.1 U13.4(EN) ; port USB0_EN
NetJ1_A18: R103.1 U14.4(EN) ; port USB1_EN
NetR102_2: R102.2 U13.3(/FLT)
NetR103_2: R103.2 U14.3(/FLT)

Not connected (* = marked no-connect by the designer): D13 4(D2-); D16 1(D1+) 2(D1-)

### Layout directives
differential pair; net class diff90: USB0_D_N, USB0_D_P, USB0_RX_N, USB0_RX_P, USB0_TX_N, USB0_TX_P, USB0_TXc_N, USB0_TXc_P, USB1_D_N, USB1_D_P, USB1_RX_N, USB1_RX_P, USB1_TX_N, USB1_TX_P, USB1_TXc_N, USB1_TXc_P

### Notes on the sheet
- USB 3.0 Host
- Title
- Size:
- Date:
- A4
- Number:
- Time:
- Revision:
- Sheet
- of
- Repo:

### Library data of the parts
C86-C89 C92-C95 = cap: Capacitor; Manufacturer: *; Series: *
C90 C91 C96 C97 = cap: Capacitor; Voltage: 25V; Type: X7R; Manufacturer: *; Series: *
FB18 FB19 = ferrite_bead: Ferrite bead
R102 R103 = res: Resistor